# EAGLE design TPS24750V1_8A_editsV6 (EAGLE 8.0.0)
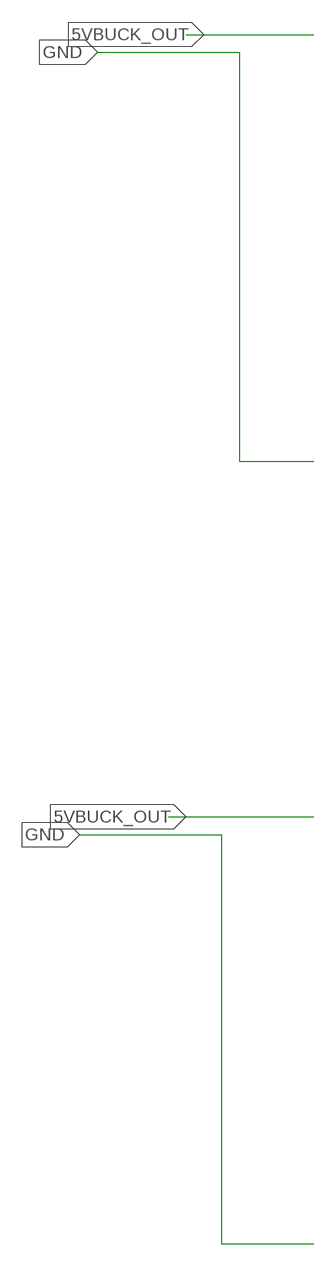
[diagram p0: schematic, sheet 1, part 1 of 3]
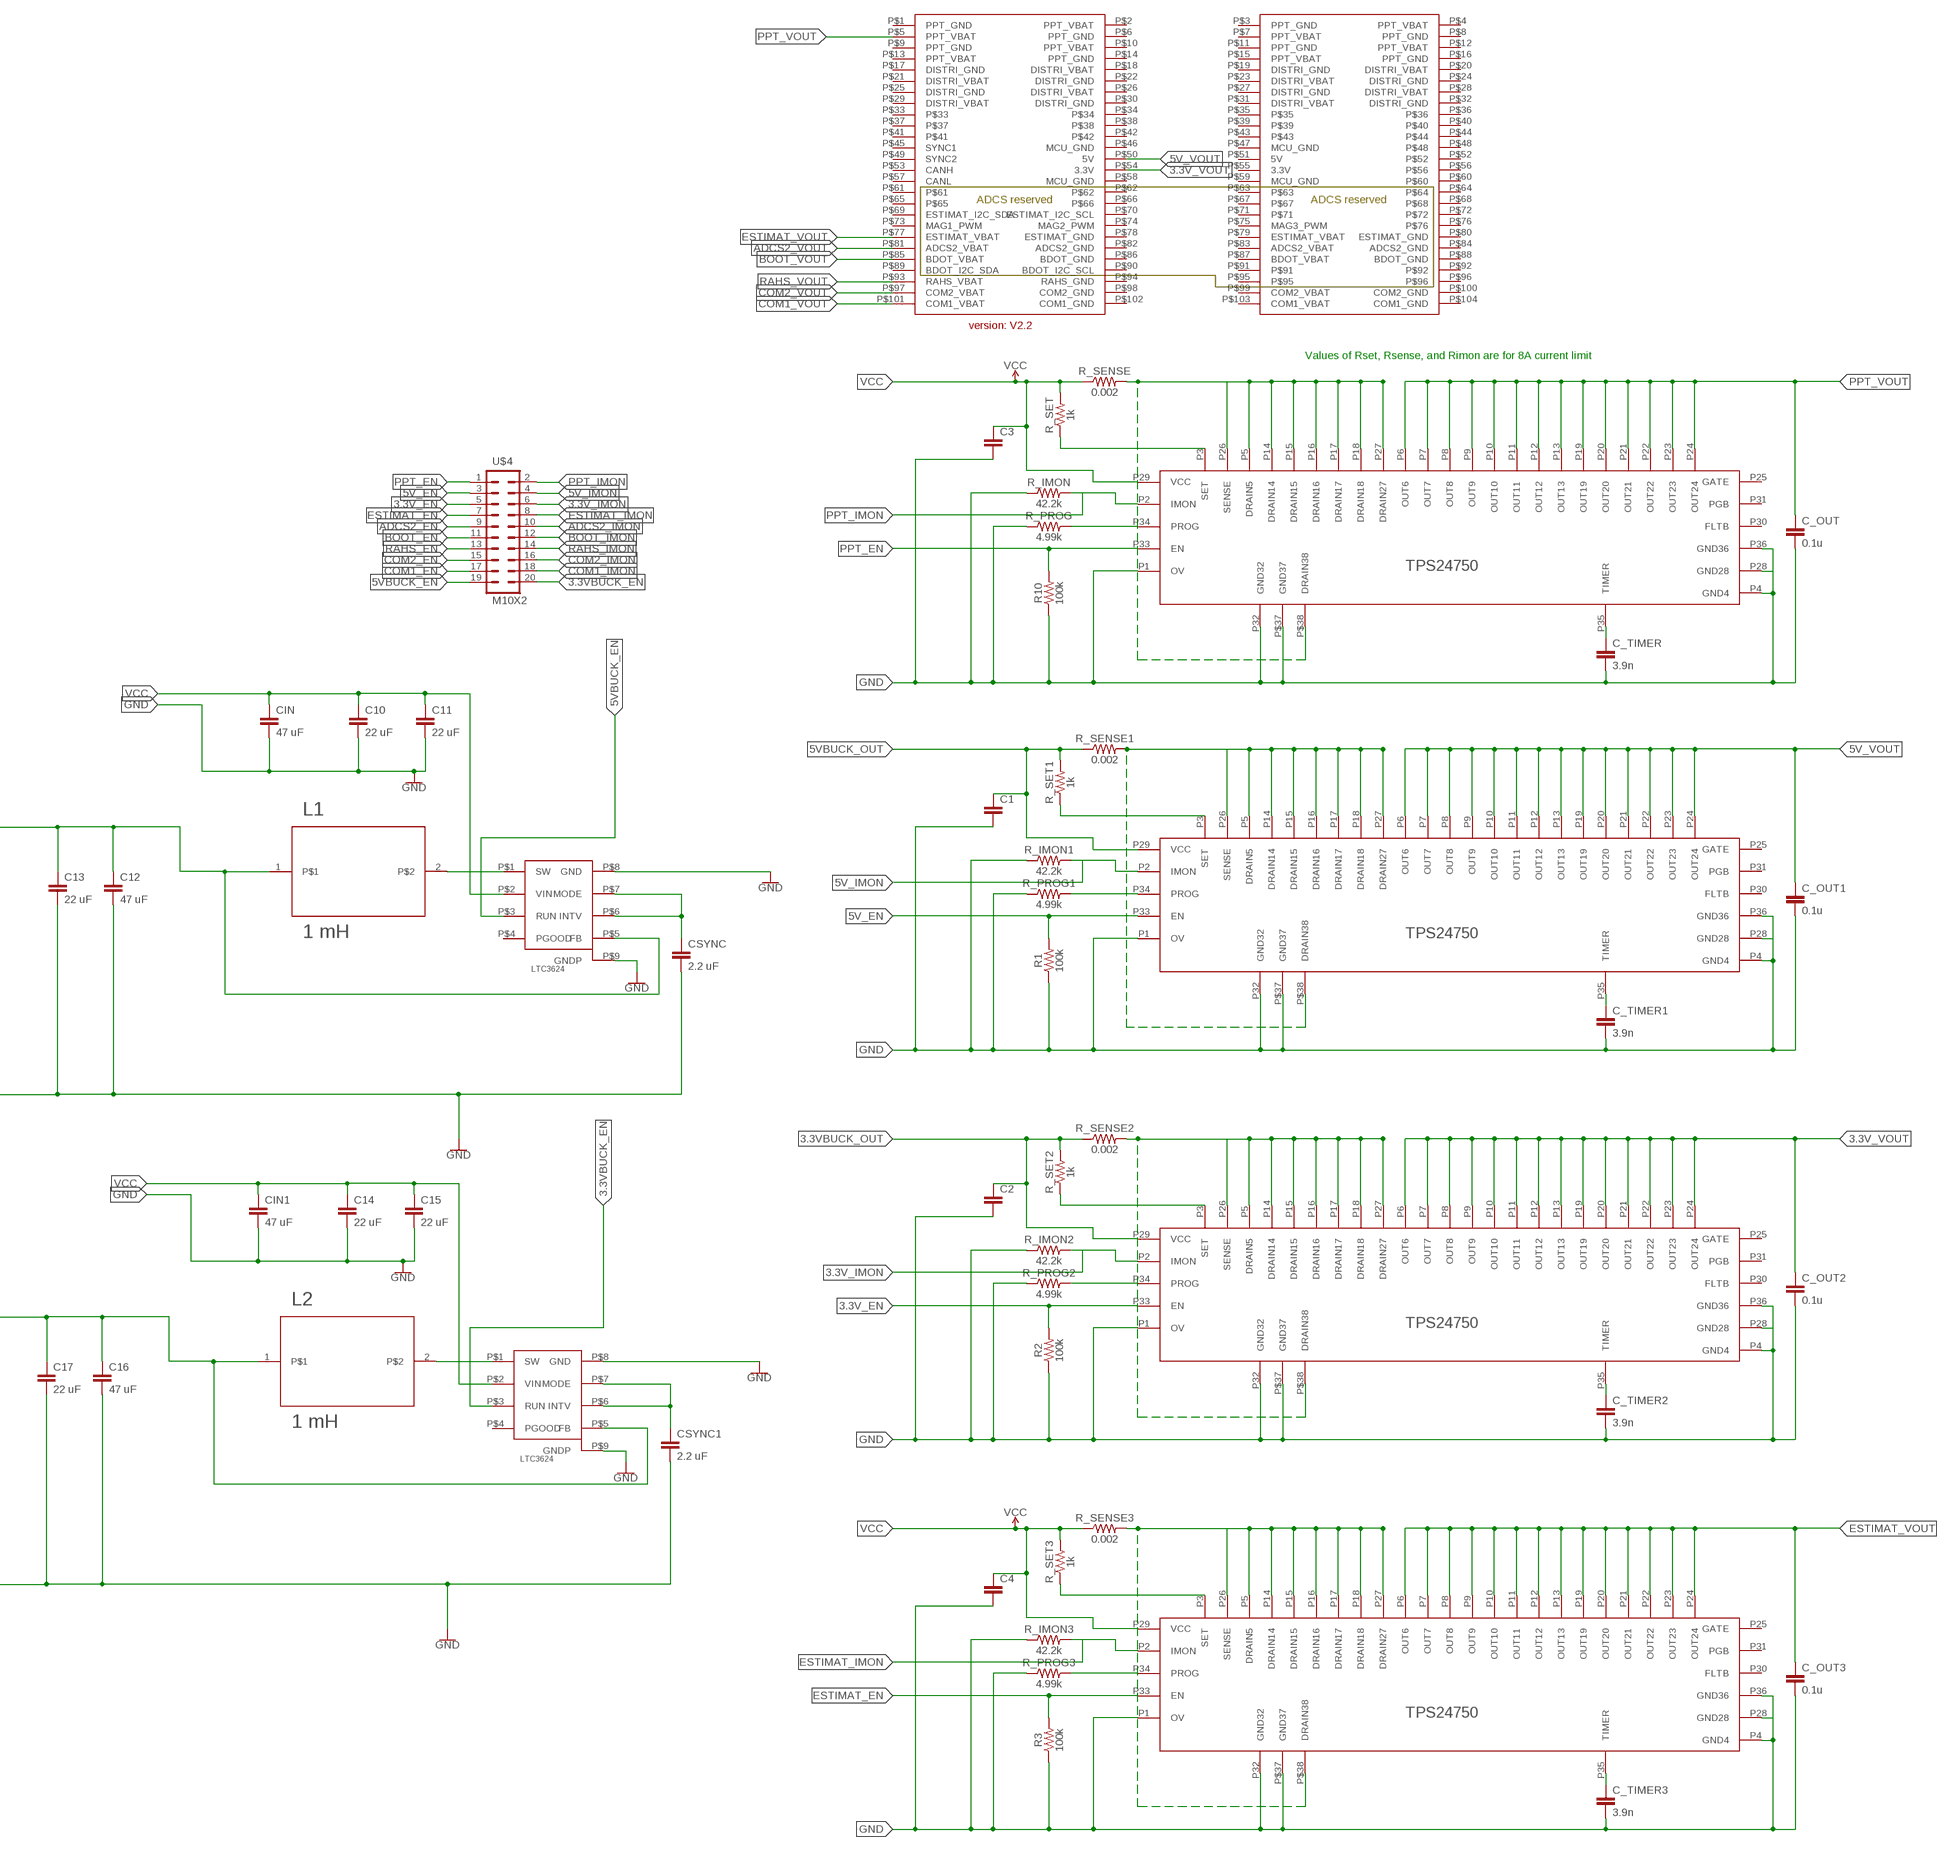
[diagram p1: schematic, sheet 1, part 2 of 3]
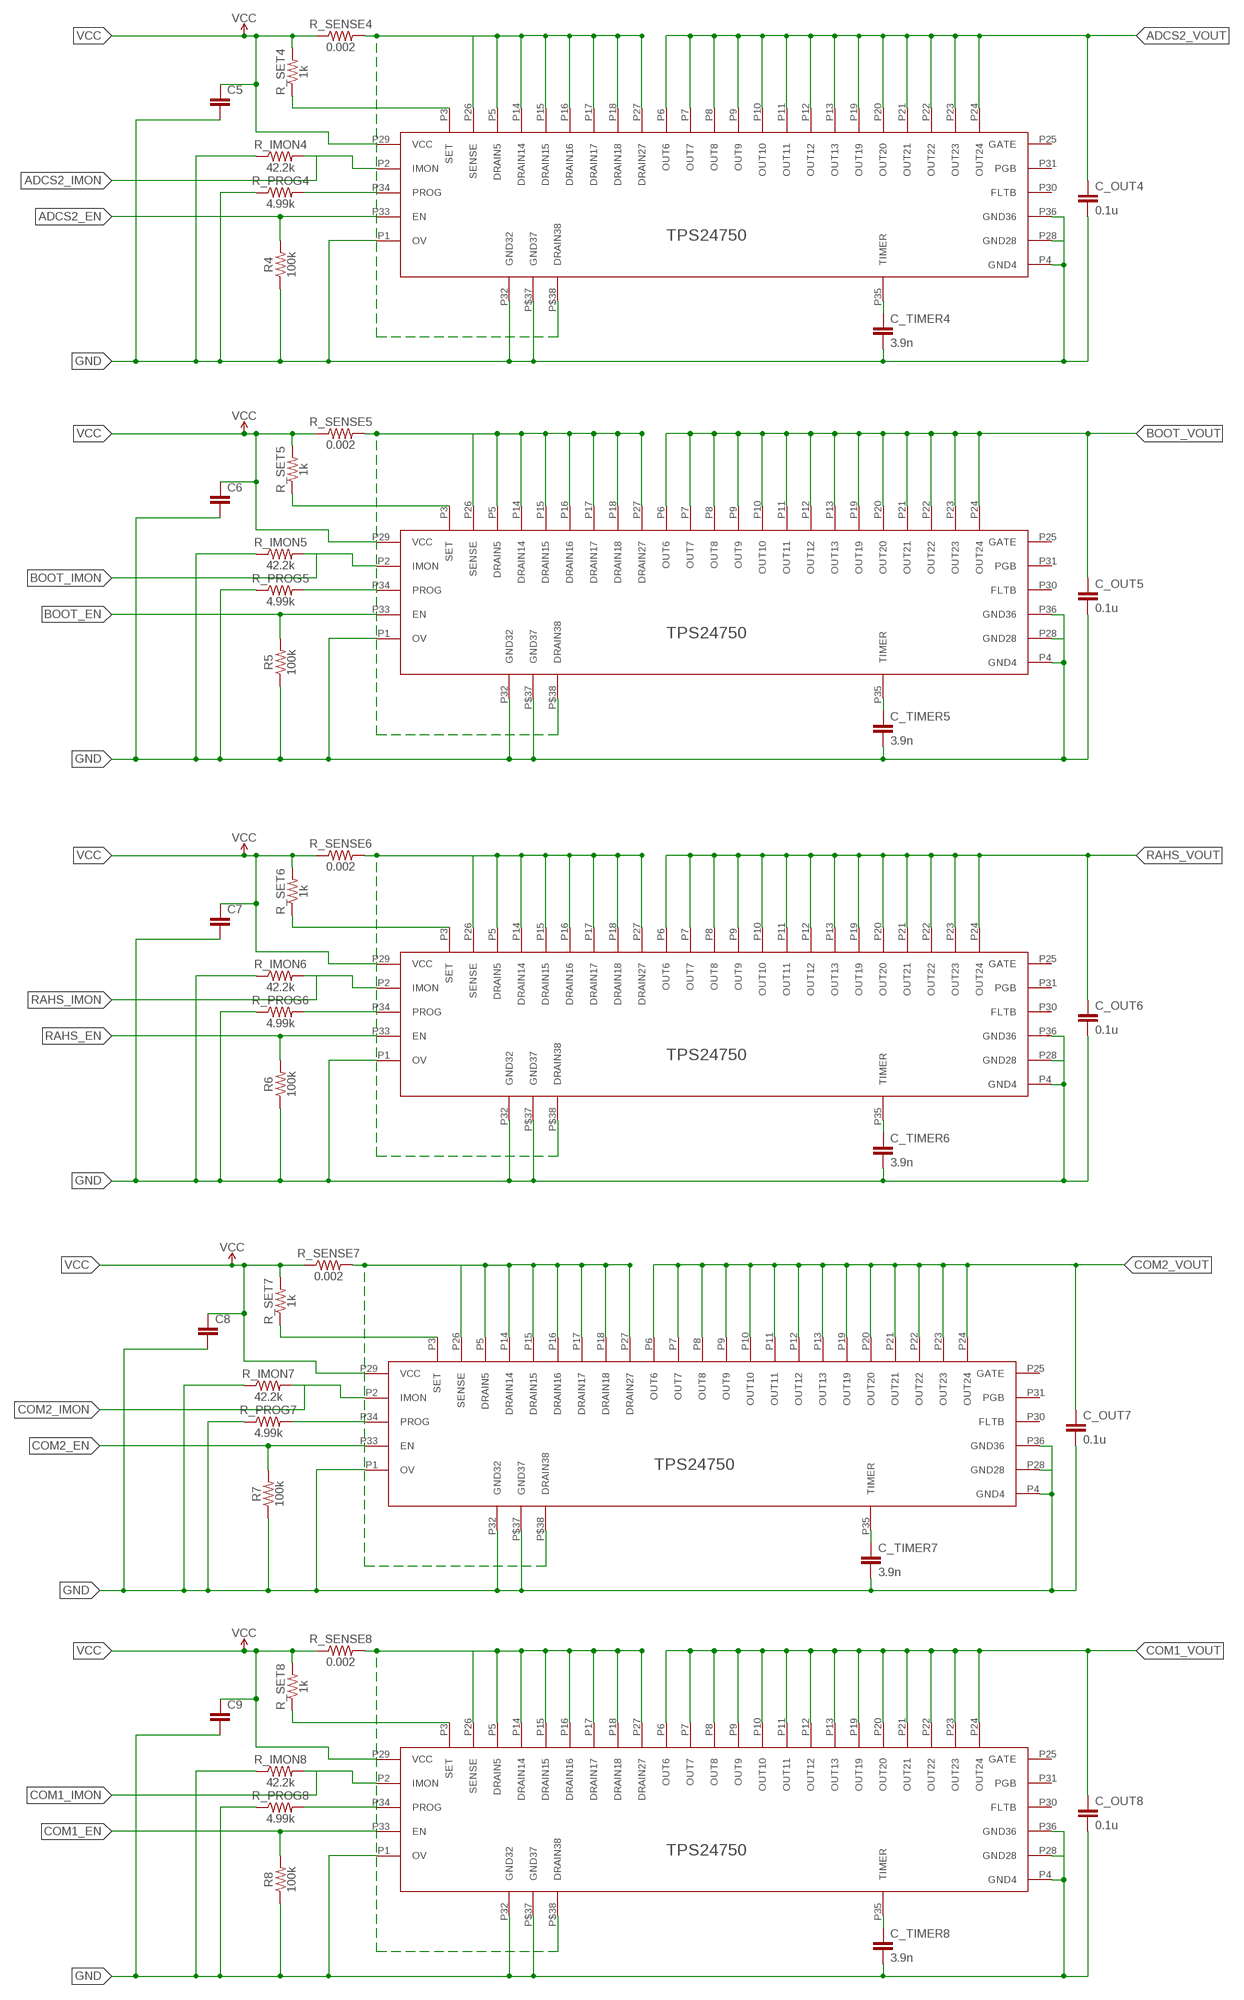
[diagram p2: schematic, sheet 1, part 3 of 3]

## Parts
C1  GEN_CAP_0805SMD  [0805]
C2  GEN_CAP_0805SMD  [0805]
C3  GEN_CAP_0805SMD  [0805]
C4  GEN_CAP_0805SMD  [0805]
C5  GEN_CAP_0805SMD  [0805]
C6  GEN_CAP_0805SMD  [0805]
C7  GEN_CAP_0805SMD  [0805]
C8  GEN_CAP_0805SMD  [0805]
C9  GEN_CAP_0805SMD  [0805]
C10  22 uF  GENERIC_CAPACITOR_1206  [1206]
C11  22 uF  GENERIC_CAPACITOR_1206  [1206]
C12  47 uF  GENERIC_CAPACITOR_1206  [1206]
C13  22 uF  GENERIC_CAPACITOR_1206  [1206]
C14  22 uF  GENERIC_CAPACITOR_1206  [1206]
C15  22 uF  GENERIC_CAPACITOR_1206  [1206]
C16  47 uF  GENERIC_CAPACITOR_1206  [1206]
C17  22 uF  GENERIC_CAPACITOR_1206  [1206]
C_OUT  0.1u  GEN_CAP_0805SMD  [0805]
C_OUT1  0.1u  GEN_CAP_0805SMD  [0805]
C_OUT2  0.1u  GEN_CAP_0805SMD  [0805]
C_OUT3  0.1u  GEN_CAP_0805SMD  [0805]
C_OUT4  0.1u  GEN_CAP_0805SMD  [0805]
C_OUT5  0.1u  GEN_CAP_0805SMD  [0805]
C_OUT6  0.1u  GEN_CAP_0805SMD  [0805]
C_OUT7  0.1u  GEN_CAP_0805SMD  [0805]
C_OUT8  0.1u  GEN_CAP_0805SMD  [0805]
C_TIMER  3.9n  GEN_CAP_0805SMD  [0805]
C_TIMER1  3.9n  GEN_CAP_0805SMD  [0805]
C_TIMER2  3.9n  GEN_CAP_0805SMD  [0805]
C_TIMER3  3.9n  GEN_CAP_0805SMD  [0805]
C_TIMER4  3.9n  GEN_CAP_0805SMD  [0805]
C_TIMER5  3.9n  GEN_CAP_0805SMD  [0805]
C_TIMER6  3.9n  GEN_CAP_0805SMD  [0805]
C_TIMER7  3.9n  GEN_CAP_0805SMD  [0805]
C_TIMER8  3.9n  GEN_CAP_0805SMD  [0805]
CIN  47 uF  GENERIC_CAPACITOR_1206  [1206]
CIN1  47 uF  GENERIC_CAPACITOR_1206  [1206]
CSYNC  2.2 uF  GENERIC_CAPACITOR_0805  [0805]
CSYNC1  2.2 uF  GENERIC_CAPACITOR_0805  [0805]
L1  1 mH  XAL4030-332ME  [COILCRAFT]
L2  1 mH  XAL4030-332ME  [COILCRAFT]
R1  100k  GEN_RES_0805SMD  [0805]
R2  100k  GEN_RES_0805SMD  [0805]
R3  100k  GEN_RES_0805SMD  [0805]
R4  100k  GEN_RES_0805SMD  [0805]
R5  100k  GEN_RES_0805SMD  [0805]
R6  100k  GEN_RES_0805SMD  [0805]
R7  100k  GEN_RES_0805SMD  [0805]
R8  100k  GEN_RES_0805SMD  [0805]
R10  100k  GEN_RES_0805SMD  [0805]
R_IMON  42.2k  GEN_RES_0805SMD  [0805]
R_IMON1  42.2k  GEN_RES_0805SMD  [0805]
R_IMON2  42.2k  GEN_RES_0805SMD  [0805]
R_IMON3  42.2k  GEN_RES_0805SMD  [0805]
R_IMON4  42.2k  GEN_RES_0805SMD  [0805]
R_IMON5  42.2k  GEN_RES_0805SMD  [0805]
R_IMON6  42.2k  GEN_RES_0805SMD  [0805]
R_IMON7  42.2k  GEN_RES_0805SMD  [0805]
R_IMON8  42.2k  GEN_RES_0805SMD  [0805]
R_PROG  4.99k  GEN_RES_0805SMD  [0805]
R_PROG1  4.99k  GEN_RES_0805SMD  [0805]
R_PROG2  4.99k  GEN_RES_0805SMD  [0805]
R_PROG3  4.99k  GEN_RES_0805SMD  [0805]
R_PROG4  4.99k  GEN_RES_0805SMD  [0805]
R_PROG5  4.99k  GEN_RES_0805SMD  [0805]
R_PROG6  4.99k  GEN_RES_0805SMD  [0805]
R_PROG7  4.99k  GEN_RES_0805SMD  [0805]
R_PROG8  4.99k  GEN_RES_0805SMD  [0805]
R_SENSE  0.002  GEN_RES_2010SMD  [2010]
R_SENSE1  0.002  GEN_RES_2010SMD  [2010]
R_SENSE2  0.002  GEN_RES_2010SMD  [2010]
R_SENSE3  0.002  GEN_RES_2010SMD  [2010]
R_SENSE4  0.002  GEN_RES_2010SMD  [2010]
R_SENSE5  0.002  GEN_RES_2010SMD  [2010]
R_SENSE6  0.002  GEN_RES_2010SMD  [2010]
R_SENSE7  0.002  GEN_RES_2010SMD  [2010]
R_SENSE8  0.002  GEN_RES_2010SMD  [2010]
R_SET  1k  GEN_RES_0805SMD  [0805]
R_SET1  1k  GEN_RES_0805SMD  [0805]
R_SET2  1k  GEN_RES_0805SMD  [0805]
R_SET3  1k  GEN_RES_0805SMD  [0805]
R_SET4  1k  GEN_RES_0805SMD  [0805]
R_SET5  1k  GEN_RES_0805SMD  [0805]
R_SET6  1k  GEN_RES_0805SMD  [0805]
R_SET7  1k  GEN_RES_0805SMD  [0805]
R_SET8  1k  GEN_RES_0805SMD  [0805]
U$1  TI_SWITCH_TPS24750  [QFN-36]
U$2  2X26_CONNECTOR_(V2.2)  [4X26_CONNECTOR_(V2.2)]
U$4  M10X2  [2X10]
U$5  TI_SWITCH_TPS24750  [QFN-36]
U$6  TI_SWITCH_TPS24750  [QFN-36]
U$7  TI_SWITCH_TPS24750  [QFN-36]
U$8  TI_SWITCH_TPS24750  [QFN-36]
U$9  TI_SWITCH_TPS24750  [QFN-36]
U$10  TI_SWITCH_TPS24750  [QFN-36]
U$11  TI_SWITCH_TPS24750  [QFN-36]
U$12  TI_SWITCH_TPS24750  [QFN-36]
U$13  LINEAR_BUCK_LTC3624  [8-LFCSP]
U$14  LINEAR_BUCK_LTC3624  [8-LFCSP]

## Nets
3.3V_EN: R2.2 U$4.5 U$6.P33(EN)
3.3V_IMON: R_IMON2.2 U$4.6 U$6.P2(IMON)
3.3V_VOUT: C_OUT2.1 U$2.P$54(3.3V) U$6.P6(OUT6) U$6.P7(OUT7) U$6.P8(OUT8) U$6.P9(OUT9) U$6.P10(OUT10) U$6.P11(OUT11) U$6.P12(OUT12) U$6.P13(OUT13) U$6.P19(OUT19) U$6.P20(OUT20) U$6.P21(OUT21) U$6.P22(OUT22) U$6.P23(OUT23) U$6.P24(OUT24)
3.3VBUCK_EN: U$4.20 U$14.P$3(RUN)
3.3VBUCK_OUT: C2.1 C16.1 C17.1 L2.1 R_SENSE2.1 R_SET2.2 U$6.P29(VCC) U$14.P$5(FB)
5V_EN: R1.2 U$4.3 U$5.P33(EN)
5V_IMON: R_IMON1.2 U$4.4 U$5.P2(IMON)
5V_VOUT: C_OUT1.1 U$2.P$50(5V) U$5.P6(OUT6) U$5.P7(OUT7) U$5.P8(OUT8) U$5.P9(OUT9) U$5.P10(OUT10) U$5.P11(OUT11) U$5.P12(OUT12) U$5.P13(OUT13) U$5.P19(OUT19) U$5.P20(OUT20) U$5.P21(OUT21) U$5.P22(OUT22) U$5.P23(OUT23) U$5.P24(OUT24)
5VBUCK_EN: U$4.19 U$13.P$3(RUN)
5VBUCK_OUT: C1.1 C12.1 C13.1 L1.1 R_SENSE1.1 R_SET1.2 U$5.P29(VCC) U$13.P$5(FB)
ADCS2_EN: R4.2 U$4.9 U$8.P33(EN)
ADCS2_IMON: R_IMON4.2 U$4.10 U$8.P2(IMON)
ADCS2_VOUT: C_OUT4.1 U$2.P$81(ADCS2_VBAT) U$8.P6(OUT6) U$8.P7(OUT7) U$8.P8(OUT8) U$8.P9(OUT9) U$8.P10(OUT10) U$8.P11(OUT11) U$8.P12(OUT12) U$8.P13(OUT13) U$8.P19(OUT19) U$8.P20(OUT20) U$8.P21(OUT21) U$8.P22(OUT22) U$8.P23(OUT23) U$8.P24(OUT24)
BOOT_EN: R5.2 U$9.P33(EN)
BOOT_IMON: R_IMON5.2 U$9.P2(IMON)
BOOT_VOUT: C_OUT5.1 U$2.P$85(BDOT_VBAT) U$9.P6(OUT6) U$9.P7(OUT7) U$9.P8(OUT8) U$9.P9(OUT9) U$9.P10(OUT10) U$9.P11(OUT11) U$9.P12(OUT12) U$9.P13(OUT13) U$9.P19(OUT19) U$9.P20(OUT20) U$9.P21(OUT21) U$9.P22(OUT22) U$9.P23(OUT23) U$9.P24(OUT24)
COM1_EN: R8.2 U$4.17 U$12.P33(EN)
COM1_IMON: R_IMON8.2 U$12.P2(IMON)
COM1_VOUT: C_OUT8.1 U$2.P$101(COM1_VBAT) U$12.P6(OUT6) U$12.P7(OUT7) U$12.P8(OUT8) U$12.P9(OUT9) U$12.P10(OUT10) U$12.P11(OUT11) U$12.P12(OUT12) U$12.P13(OUT13) U$12.P19(OUT19) U$12.P20(OUT20) U$12.P21(OUT21) U$12.P22(OUT22) U$12.P23(OUT23) U$12.P24(OUT24)
COM2_EN: R7.2 U$11.P33(EN)
COM2_IMON: R_IMON7.2 U$4.16 U$11.P2(IMON)
COM2_VOUT: C_OUT7.1 U$2.P$97(COM2_VBAT) U$11.P6(OUT6) U$11.P7(OUT7) U$11.P8(OUT8) U$11.P9(OUT9) U$11.P10(OUT10) U$11.P11(OUT11) U$11.P12(OUT12) U$11.P13(OUT13) U$11.P19(OUT19) U$11.P20(OUT20) U$11.P21(OUT21) U$11.P22(OUT22) U$11.P23(OUT23) U$11.P24(OUT24)
DRAIN: R_SENSE.2 U$1.P5(DRAIN5) U$1.P14(DRAIN14) U$1.P15(DRAIN15) U$1.P16(DRAIN16) U$1.P17(DRAIN17) U$1.P18(DRAIN18) U$1.P26(SENSE) U$1.P27(DRAIN27) U$1.P$38(DRAIN38)
DRAIN1: R_SENSE1.2 U$5.P5(DRAIN5) U$5.P14(DRAIN14) U$5.P15(DRAIN15) U$5.P16(DRAIN16) U$5.P17(DRAIN17) U$5.P18(DRAIN18) U$5.P26(SENSE) U$5.P27(DRAIN27) U$5.P$38(DRAIN38)
DRAIN2: R_SENSE2.2 U$6.P5(DRAIN5) U$6.P14(DRAIN14) U$6.P15(DRAIN15) U$6.P16(DRAIN16) U$6.P17(DRAIN17) U$6.P18(DRAIN18) U$6.P26(SENSE) U$6.P27(DRAIN27) U$6.P$38(DRAIN38)
DRAIN3: R_SENSE3.2 U$7.P5(DRAIN5) U$7.P14(DRAIN14) U$7.P15(DRAIN15) U$7.P16(DRAIN16) U$7.P17(DRAIN17) U$7.P18(DRAIN18) U$7.P26(SENSE) U$7.P27(DRAIN27) U$7.P$38(DRAIN38)
DRAIN4: R_SENSE4.2 U$8.P5(DRAIN5) U$8.P14(DRAIN14) U$8.P15(DRAIN15) U$8.P16(DRAIN16) U$8.P17(DRAIN17) U$8.P18(DRAIN18) U$8.P26(SENSE) U$8.P27(DRAIN27) U$8.P$38(DRAIN38)
DRAIN5: R_SENSE5.2 U$9.P5(DRAIN5) U$9.P14(DRAIN14) U$9.P15(DRAIN15) U$9.P16(DRAIN16) U$9.P17(DRAIN17) U$9.P18(DRAIN18) U$9.P26(SENSE) U$9.P27(DRAIN27) U$9.P$38(DRAIN38)
DRAIN6: R_SENSE6.2 U$10.P5(DRAIN5) U$10.P14(DRAIN14) U$10.P15(DRAIN15) U$10.P16(DRAIN16) U$10.P17(DRAIN17) U$10.P18(DRAIN18) U$10.P26(SENSE) U$10.P27(DRAIN27) U$10.P$38(DRAIN38)
DRAIN7: R_SENSE7.2 U$11.P5(DRAIN5) U$11.P14(DRAIN14) U$11.P15(DRAIN15) U$11.P16(DRAIN16) U$11.P17(DRAIN17) U$11.P18(DRAIN18) U$11.P26(SENSE) U$11.P27(DRAIN27) U$11.P$38(DRAIN38)
DRAIN8: R_SENSE8.2 U$12.P5(DRAIN5) U$12.P14(DRAIN14) U$12.P15(DRAIN15) U$12.P16(DRAIN16) U$12.P17(DRAIN17) U$12.P18(DRAIN18) U$12.P26(SENSE) U$12.P27(DRAIN27) U$12.P$38(DRAIN38)
ESTIMAT_EN: R3.2 U$4.7 U$7.P33(EN)
ESTIMAT_IMON: R_IMON3.2 U$4.8 U$7.P2(IMON)
ESTIMAT_VOUT: C_OUT3.1 U$2.P$77(ESTIMAT_VBAT) U$7.P6(OUT6) U$7.P7(OUT7) U$7.P8(OUT8) U$7.P9(OUT9) U$7.P10(OUT10) U$7.P11(OUT11) U$7.P12(OUT12) U$7.P13(OUT13) U$7.P19(OUT19) U$7.P20(OUT20) U$7.P21(OUT21) U$7.P22(OUT22) U$7.P23(OUT23) U$7.P24(OUT24)
GND: C1.2 C2.2 C3.2 C4.2 C5.2 C6.2 C7.2 C8.2 C9.2 C10.2 C11.2 C12.2 C13.2 C14.2 C15.2 C16.2 C17.2 C_OUT1.2 C_OUT2.2 C_OUT3.2 C_OUT4.2 C_OUT5.2 C_OUT6.2 C_OUT7.2 C_OUT8.2 C_OUT.2 C_TIMER1.2 C_TIMER2.2 C_TIMER3.2 C_TIMER4.2 C_TIMER5.2 C_TIMER6.2 C_TIMER7.2 C_TIMER8.2 C_TIMER.2 CIN1.2 CIN.2 CSYNC1.2 CSYNC.2 R1.1 R2.1 R3.1 R4.1 R5.1 R6.1 R7.1 R8.1 R10.1 R_IMON1.1 R_IMON2.1 R_IMON3.1 R_IMON4.1 R_IMON5.1 R_IMON6.1 R_IMON7.1 R_IMON8.1 R_IMON.1 R_PROG1.1 R_PROG2.1 R_PROG3.1 R_PROG4.1 R_PROG5.1 R_PROG6.1 R_PROG7.1 R_PROG8.1 R_PROG.1 U$1.P1(OV) U$1.P4(GND4) U$1.P28(GND28) U$1.P32(GND32) U$1.P36(GND36) U$1.P$37(GND37) U$5.P1(OV) U$5.P4(GND4) U$5.P28(GND28) U$5.P32(GND32) U$5.P36(GND36) U$5.P$37(GND37) U$6.P1(OV) U$6.P4(GND4) U$6.P28(GND28) U$6.P32(GND32) U$6.P36(GND36) U$6.P$37(GND37) U$7.P1(OV) U$7.P4(GND4) U$7.P28(GND28) U$7.P32(GND32) U$7.P36(GND36) U$7.P$37(GND37) U$8.P1(OV) U$8.P4(GND4) U$8.P28(GND28) U$8.P32(GND32) U$8.P36(GND36) U$8.P$37(GND37) U$9.P1(OV) U$9.P4(GND4) U$9.P28(GND28) U$9.P32(GND32) U$9.P36(GND36) U$9.P$37(GND37) U$10.P1(OV) U$10.P4(GND4) U$10.P28(GND28) U$10.P32(GND32) U$10.P36(GND36) U$10.P$37(GND37) U$11.P1(OV) U$11.P4(GND4) U$11.P28(GND28) U$11.P32(GND32) U$11.P36(GND36) U$11.P$37(GND37) U$12.P1(OV) U$12.P4(GND4) U$12.P28(GND28) U$12.P32(GND32) U$12.P36(GND36) U$12.P$37(GND37) U$13.P$8(GND) U$13.P$9(GNDP) U$14.P$8(GND) U$14.P$9(GNDP)
INPUT6_EN: U$4.11
INPUT6_IMON: U$4.12
INPUT8_EN: U$4.15
INPUT9_IMON: U$4.18
MODE: CSYNC.1 U$13.P$6(INTV) U$13.P$7(MODE)
MODE1: CSYNC1.1 U$14.P$6(INTV) U$14.P$7(MODE)
PPT_EN: R10.2 U$1.P33(EN) U$4.1
PPT_IMON: R_IMON.2 U$1.P2(IMON) U$4.2
PPT_VOUT: C_OUT.1 U$1.P6(OUT6) U$1.P7(OUT7) U$1.P8(OUT8) U$1.P9(OUT9) U$1.P10(OUT10) U$1.P11(OUT11) U$1.P12(OUT12) U$1.P13(OUT13) U$1.P19(OUT19) U$1.P20(OUT20) U$1.P21(OUT21) U$1.P22(OUT22) U$1.P23(OUT23) U$1.P24(OUT24) U$2.P$5(PPT_VBAT)
PROG: R_PROG.2 U$1.P34(PROG)
PROG1: R_PROG1.2 U$5.P34(PROG)
PROG2: R_PROG2.2 U$6.P34(PROG)
PROG3: R_PROG3.2 U$7.P34(PROG)
PROG4: R_PROG4.2 U$8.P34(PROG)
PROG5: R_PROG5.2 U$9.P34(PROG)
PROG6: R_PROG6.2 U$10.P34(PROG)
PROG7: R_PROG7.2 U$11.P34(PROG)
PROG8: R_PROG8.2 U$12.P34(PROG)
RAHS_EN: R6.2 U$4.13 U$10.P33(EN)
RAHS_IMON: R_IMON6.2 U$4.14 U$10.P2(IMON)
RAHS_VOUT: C_OUT6.1 U$2.P$93(RAHS_VBAT) U$10.P6(OUT6) U$10.P7(OUT7) U$10.P8(OUT8) U$10.P9(OUT9) U$10.P10(OUT10) U$10.P11(OUT11) U$10.P12(OUT12) U$10.P13(OUT13) U$10.P19(OUT19) U$10.P20(OUT20) U$10.P21(OUT21) U$10.P22(OUT22) U$10.P23(OUT23) U$10.P24(OUT24)
SET: R_SET.1 U$1.P3(SET)
SET1: R_SET1.1 U$5.P3(SET)
SET2: R_SET2.1 U$6.P3(SET)
SET3: R_SET3.1 U$7.P3(SET)
SET4: R_SET4.1 U$8.P3(SET)
SET5: R_SET5.1 U$9.P3(SET)
SET6: R_SET6.1 U$10.P3(SET)
SET7: R_SET7.1 U$11.P3(SET)
SET8: R_SET8.1 U$12.P3(SET)
SW: L1.2 U$13.P$1(SW)
SW1: L2.2 U$14.P$1(SW)
TIMER: C_TIMER.1 U$1.P35(TIMER)
TIMER1: C_TIMER1.1 U$5.P35(TIMER)
TIMER2: C_TIMER2.1 U$6.P35(TIMER)
TIMER3: C_TIMER3.1 U$7.P35(TIMER)
TIMER4: C_TIMER4.1 U$8.P35(TIMER)
TIMER5: C_TIMER5.1 U$9.P35(TIMER)
TIMER6: C_TIMER6.1 U$10.P35(TIMER)
TIMER7: C_TIMER7.1 U$11.P35(TIMER)
TIMER8: C_TIMER8.1 U$12.P35(TIMER)
VCC: C3.1 C4.1 C5.1 C6.1 C7.1 C8.1 C9.1 C10.1 C11.1 C14.1 C15.1 CIN1.1 CIN.1 R_SENSE3.1 R_SENSE4.1 R_SENSE5.1 R_SENSE6.1 R_SENSE7.1 R_SENSE8.1 R_SENSE.1 R_SET3.2 R_SET4.2 R_SET5.2 R_SET6.2 R_SET7.2 R_SET8.2 R_SET.2 U$1.P29(VCC) U$7.P29(VCC) U$8.P29(VCC) U$9.P29(VCC) U$10.P29(VCC) U$11.P29(VCC) U$12.P29(VCC) U$13.P$2(VIN) U$14.P$2(VIN)
Unconnected: U$1.P25(GATE) U$1.P30(FLTB) U$1.P31(PGB) U$2.P$1(PPT_GND) U$2.P$2(PPT_VBAT) U$2.P$3(PPT_GND) U$2.P$4(PPT_VBAT) U$2.P$6(PPT_GND) U$2.P$7(PPT_VBAT) U$2.P$8(PPT_GND) U$2.P$9(PPT_GND) U$2.P$10(PPT_VBAT) U$2.P$11(PPT_GND) U$2.P$12(PPT_VBAT) U$2.P$13(PPT_VBAT) U$2.P$14(PPT_GND) U$2.P$15(PPT_VBAT) U$2.P$16(PPT_GND) U$2.P$17(DISTRI_GND) U$2.P$18(DISTRI_VBAT) U$2.P$19(DISTRI_GND) U$2.P$20(DISTRI_VBAT) U$2.P$21(DISTRI_VBAT) U$2.P$22(DISTRI_GND) U$2.P$23(DISTRI_VBAT) U$2.P$24(DISTRI_GND) U$2.P$25(DISTRI_GND) U$2.P$26(DISTRI_VBAT) U$2.P$27(DISTRI_GND) U$2.P$28(DISTRI_VBAT) U$2.P$29(DISTRI_VBAT) U$2.P$30(DISTRI_GND) U$2.P$31(DISTRI_VBAT) U$2.P$32(DISTRI_GND) U$2.P$33 U$2.P$34 U$2.P$35 U$2.P$36 U$2.P$37 U$2.P$38 U$2.P$39 U$2.P$40 U$2.P$41 U$2.P$42 U$2.P$43 U$2.P$44 U$2.P$45(SYNC1) U$2.P$46(MCU_GND) U$2.P$47(MCU_GND) U$2.P$48 U$2.P$49(SYNC2) U$2.P$51(5V) U$2.P$52 U$2.P$53(CANH) U$2.P$55(3.3V) U$2.P$56 U$2.P$57(CANL) U$2.P$58(MCU_GND) U$2.P$59(MCU_GND) U$2.P$60 U$2.P$61 U$2.P$62 U$2.P$63 U$2.P$64 U$2.P$65 U$2.P$66 U$2.P$67 U$2.P$68 U$2.P$69(ESTIMAT_I2C_SDA) U$2.P$70(ESTIMAT_I2C_SCL) U$2.P$71 U$2.P$72 U$2.P$73(MAG1_PWM) U$2.P$74(MAG2_PWM) U$2.P$75(MAG3_PWM) U$2.P$76 U$2.P$78(ESTIMAT_GND) U$2.P$79(ESTIMAT_VBAT) U$2.P$80(ESTIMAT_GND) U$2.P$82(ADCS2_GND) U$2.P$83(ADCS2_VBAT) U$2.P$84(ADCS2_GND) U$2.P$86(BDOT_GND) U$2.P$87(BDOT_VBAT) U$2.P$88(BDOT_GND) U$2.P$89(BDOT_I2C_SDA) U$2.P$90(BDOT_I2C_SCL) U$2.P$91 U$2.P$92 U$2.P$94(RAHS_GND) U$2.P$95 U$2.P$96 U$2.P$98(COM2_GND) U$2.P$99(COM2_VBAT) U$2.P$100(COM2_GND) U$2.P$102(COM1_GND) U$2.P$103(COM1_VBAT) U$2.P$104(COM1_GND) U$5.P25(GATE) U$5.P30(FLTB) U$5.P31(PGB) U$6.P25(GATE) U$6.P30(FLTB) U$6.P31(PGB) U$7.P25(GATE) U$7.P30(FLTB) U$7.P31(PGB) U$8.P25(GATE) U$8.P30(FLTB) U$8.P31(PGB) U$9.P25(GATE) U$9.P30(FLTB) U$9.P31(PGB) U$10.P25(GATE) U$10.P30(FLTB) U$10.P31(PGB) U$11.P25(GATE) U$11.P30(FLTB) U$11.P31(PGB) U$12.P25(GATE) U$12.P30(FLTB) U$12.P31(PGB) U$13.P$4(PGOOD) U$14.P$4(PGOOD)

## Notes on the sheet
- Values of Rset, Rsense, and Rimon are for 8A current limit

## Library data of the parts
C1-C9 C_OUT C_OUT1-C_OUT8 C_TIMER C_TIMER1-C_TIMER8 = SparkFun-Capacitors:GEN_CAP_0805
C10-C17 CIN CIN1 = SparkFun-Capacitors:GENERIC_CAPACITOR_1206
CSYNC CSYNC1 = SparkFun-Capacitors:GENERIC_CAPACITOR_0805
L1 L2 = Inductors:XAL4030-332ME
R1-R8 R10 R_IMON R_IMON1-R_IMON8 R_PROG R_PROG1-R_PROG8 R_SET R_SET1-R_SET8 = SparkFun-Resistors:GEN_RES_0805: Generic resistor with no value
R_SENSE R_SENSE1-R_SENSE8 = SparkFun-Resistors:GEN_RES_2010
U$1 U$5-U$12 = ICs:TI_SWITCH_TPS24750
U$2 = CubeSat(V2.2):2X26_CONNECTOR_(V2.2)
U$4 = SparkFun-Connectors:M10X2: This was SPECIALLY designed to be used with our Graphic LCD Backpack. Be sure you want to use this! It is not only staggered on each line of header holes, but IT IS ALSO offset of the center point of the top and bottom lines by 5 mil. This causes the headers to lock into place on the "standard" footprint on the LCD screen. The extra squares on the tdocu layer are there simply to reference other pins (if you were to actually populate a longer header than ten long - this is what we do with the backpacks).
U$13 U$14 = ICs:LINEAR_BUCK_LTC3624

## Board
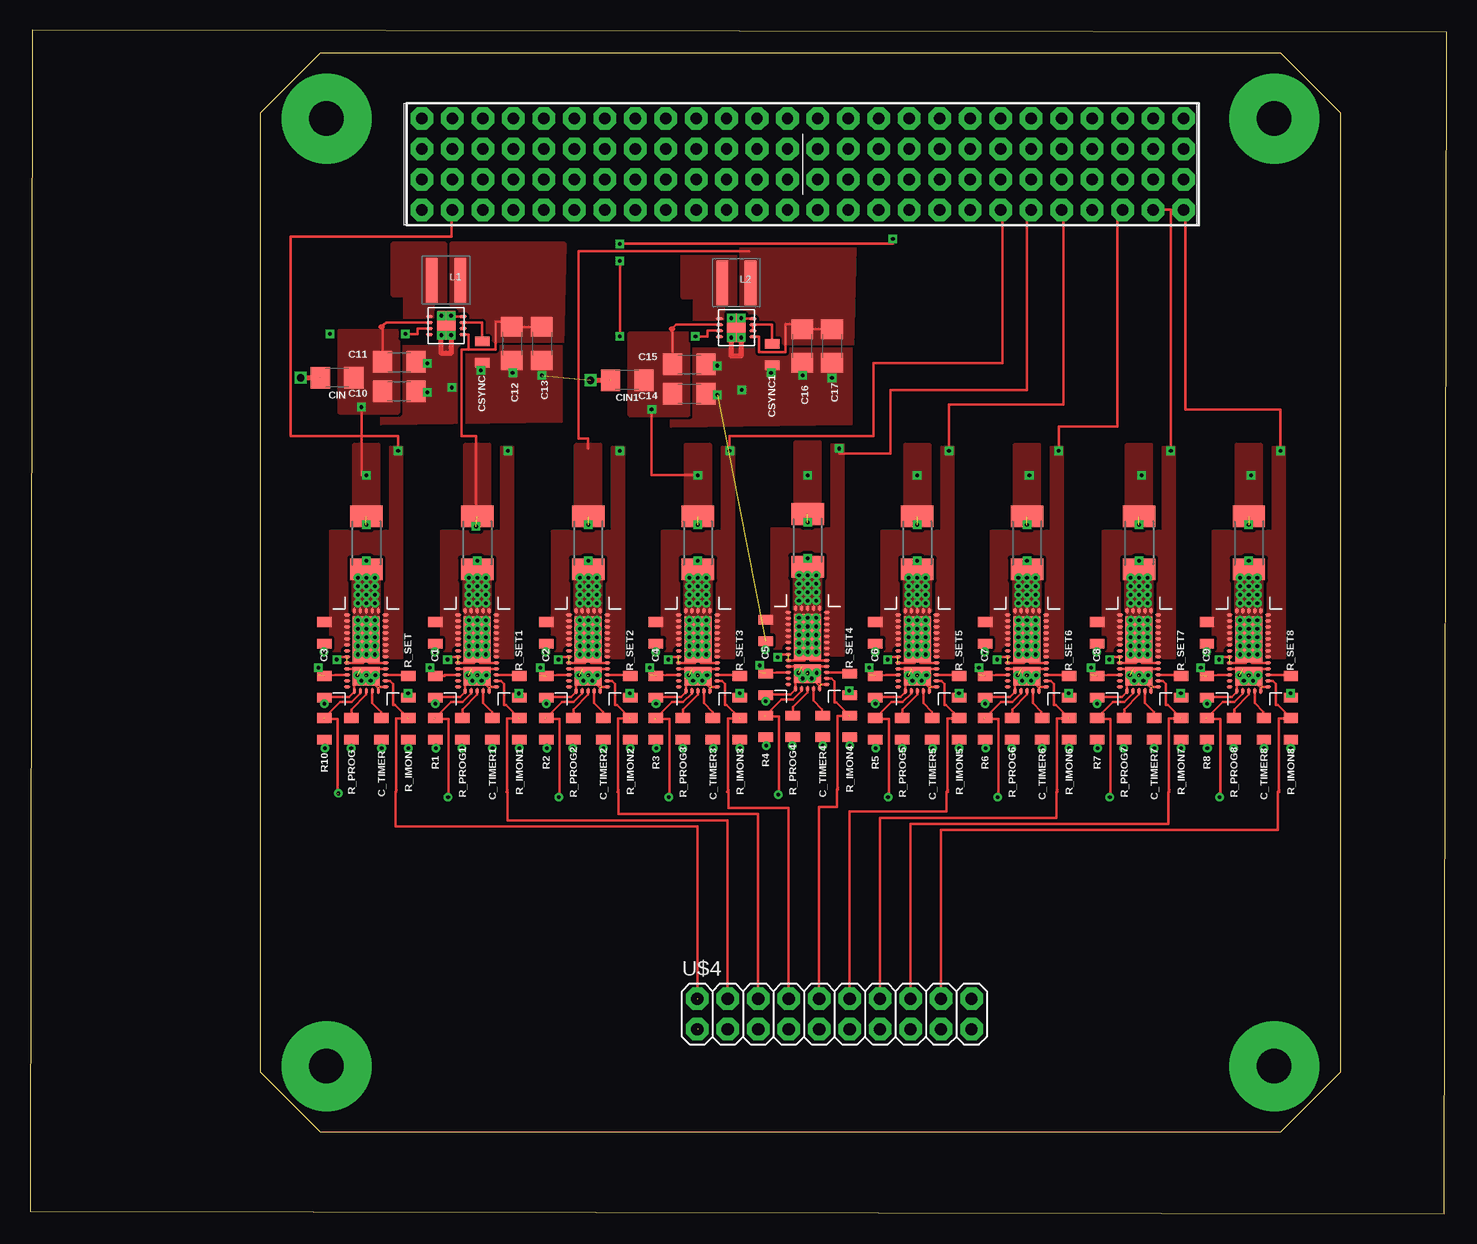
[diagram p3: board, top side]
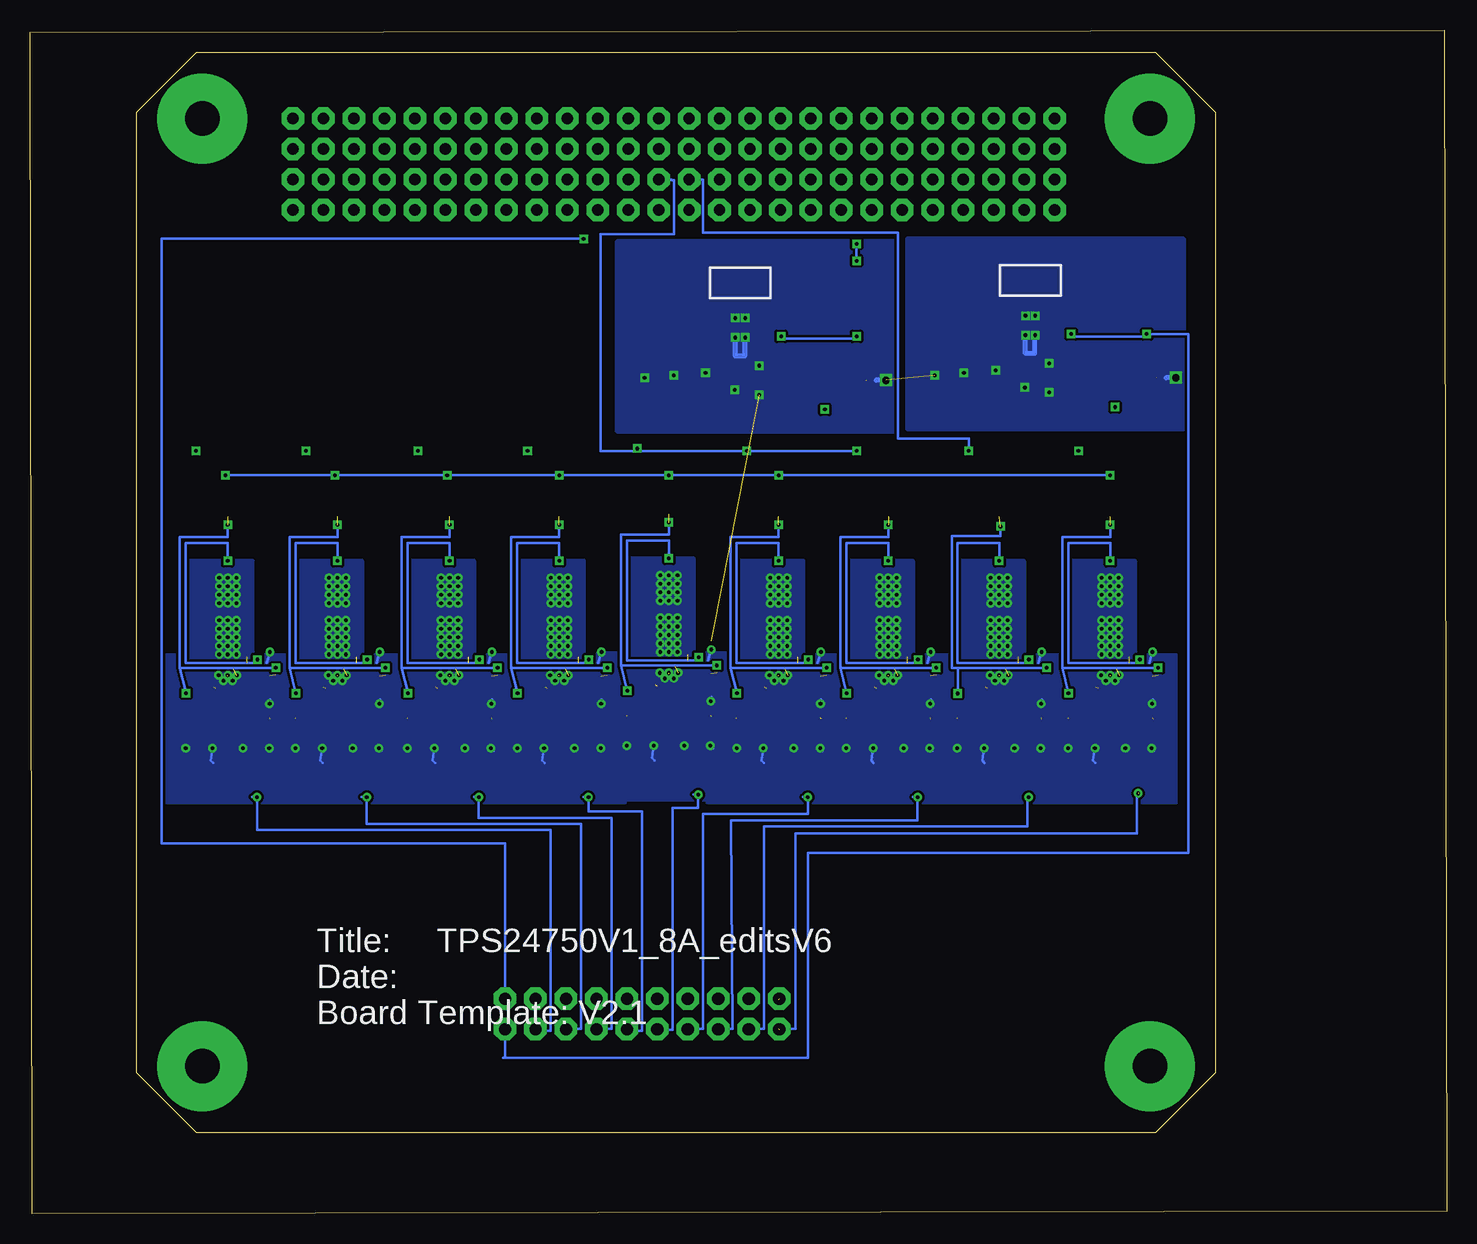
[diagram p4: board, bottom side, seen from below]

Size 118.08 x 98.69 mm. Coordinates in mm from the lower left corner, seen from the top.
Outline: 0,0.2 117.88,0 118.08,98.49 0.2,98.69 0,0.2
Copper layers (1*16): Top 0.035mm / dielectric 1.5mm / Bottom 0.035mm
Design rules "default": minimum track width 10mil, minimum drill 24mil, track to track 8mil, track to pad 8mil, pad to pad 8mil, via to via 8mil, smd to smd 8mil, copper to edge 40mil, drill to drill 8mil, minimum pad ring 10mil, minimum via ring 8mil, stop-mask expansion 4mil, vias tented up to drill 0mil, thermal gap 10mil

### Footprints (pad centres in the part's own frame; a part is rotated, then mirrored left to right if it is on the bottom)
0805 = smd 0.8 x 1.2: 1 -0.9,0; 2 0.9,0
1206 = smd 1.6 x 1.8: 1 -1.4,0; 2 1.4,0
COILCRAFT = smd 0.965 x 3.708: 1 -1.182,0; 2 1.182,0
2010 = smd 1.8 x 2.7: 1 -2.2,0; 2 2.2,0
QFN-36 = smd 0.24 x 0.5: P1 -3,-1.6; P2 -2.5,-1.6; P3 -2,-1.6; P4 -1.5,-1.6; P5 -1,-1.6; P6 -0.5,-1.6; P7 0,-1.6; P8 0.5,-1.6; P9 1,-1.6; P10 1.5,-1.6; P11 2,-1.6; P12 2.5,-1.6; P13 3,-1.6; P19 3,1.6; P20 2.5,1.6; P21 2,1.6; P22 1.5,1.6; P23 1,1.6; P24 0.5,1.6; P25 0,1.6; P26 -0.5,1.6; P27 -1,1.6; P28 -1.5,1.6; P29 -2,1.6; P30 -2.5,1.6; P31 -3,1.6 | smd 0.5 x 0.24: P14 3.35,-1; P15 3.35,-0.5; P16 3.35,0; P17 3.35,0.5; P18 3.35,1; P32 -3.35,1; P33 -3.35,0.5; P34 -3.35,0; P35 -3.35,-0.5; P36 -3.35,-1 | smd 1.514 x 2.25: P$37 -2.118,0 | smd 3.836 x 2.25: P$38 0.957,0
4X26_CONNECTOR_(V2.2) = drill 0.953 pad 1.88 octagon: P$1 -31.75,31.88; P$2 -31.75,34.42; P$3 -31.75,36.96; P$4 -31.75,39.5; P$5 -29.21,31.88; P$6 -29.21,34.42; P$7 -29.21,36.96; P$8 -29.21,39.5; P$9 -26.67,31.88; P$10 -26.67,34.42; P$11 -26.67,36.96; P$12 -26.67,39.5; P$13 -24.13,31.88; P$14 -24.13,34.42; P$15 -24.13,36.96; P$16 -24.13,39.5; P$17 -21.59,31.88; P$18 -21.59,34.42; P$19 -21.59,36.96; P$20 -21.59,39.5; P$21 -19.05,31.88; P$22 -19.05,34.42; P$23 -19.05,36.96; P$24 -19.05,39.5; P$25 -16.51,31.88; P$26 -16.51,34.42; P$27 -16.51,36.96; P$28 -16.51,39.5; P$29 -13.97,31.88; P$30 -13.97,34.42; P$31 -13.97,36.96; P$32 -13.97,39.5; P$33 -11.43,31.88; P$34 -11.43,34.42; P$35 -11.43,36.96; P$36 -11.43,39.5; P$37 -8.89,31.88; P$38 -8.89,34.42; P$39 -8.89,36.96; P$40 -8.89,39.5; P$41 -6.35,31.88; P$42 -6.35,34.42; P$43 -6.35,36.96; P$44 -6.35,39.5; P$45 -3.81,31.88; P$46 -3.81,34.42; P$47 -3.81,36.96; P$48 -3.81,39.5; P$49 -1.27,31.88; P$50 -1.27,34.42; P$51 -1.27,36.96; P$52 -1.27,39.5; P$53 1.27,31.88; P$54 1.27,34.42; P$55 1.27,36.96; P$56 1.27,39.5; P$57 3.81,31.88; P$58 3.81,34.42; P$59 3.81,36.96; P$60 3.81,39.5; P$61 6.35,31.88; P$62 6.35,34.42; P$63 6.35,36.96; P$64 6.35,39.5; P$65 8.89,31.88; P$66 8.89,34.42; P$67 8.89,36.96; P$68 8.89,39.5; P$69 11.43,31.88; P$70 11.43,34.42; P$71 11.43,36.96; P$72 11.43,39.5; P$73 13.97,31.88; P$74 13.97,34.42; P$75 13.97,36.96; P$76 13.97,39.5; P$77 16.51,31.88; P$78 16.51,34.42; P$79 16.51,36.96; P$80 16.51,39.5; P$81 19.05,31.88; P$82 19.05,34.42; P$83 19.05,36.96; P$84 19.05,39.5; P$85 21.59,31.88; P$86 21.59,34.42; P$87 21.59,36.96; P$88 21.59,39.5; P$89 24.13,31.88; P$90 24.13,34.42; P$91 24.13,36.96; P$92 24.13,39.5; P$93 26.67,31.88; P$94 26.67,34.42; P$95 26.67,36.96; P$96 26.67,39.5; P$97 29.21,31.88; P$98 29.21,34.42; P$99 29.21,36.96; P$100 29.21,39.5; P$101 31.75,31.88; P$102 31.75,34.42; P$103 31.75,36.96; P$104 31.75,39.5
BOARD_TEMPLATE_(V2.1) = drill 2.9 pad 7.5: P$1 -39.5,39.5; P$2 -39.5,-39.5; P$3 39.5,-39.5; P$4 39.5,39.5
2X10 = drill 1.016 pad 1.88 octagon: 1 -11.43,-1.27; 2 -11.43,1.27; 3 -8.89,-1.27; 4 -8.89,1.27; 5 -6.35,-1.27; 6 -6.35,1.27; 7 -3.81,-1.27; 8 -3.81,1.27; 9 -1.27,-1.27; 10 -1.27,1.27; 11 1.27,-1.27; 12 1.27,1.27; 13 3.81,-1.27; 14 3.81,1.27; 15 6.35,-1.27; 16 6.35,1.27; 17 8.89,-1.27; 18 8.89,1.27; 19 11.43,-1.27; 20 11.43,1.27
8-LFCSP = smd 0.6 x 0.24: P$1 -1.4,0.75; P$2 -1.4,0.25; P$3 -1.4,-0.25; P$4 -1.4,-0.75; P$5 1.4,-0.75; P$6 1.4,-0.25; P$7 1.4,0.25; P$8 1.4,0.75 | smd 1.6 x 2.44: P$9 0,0

### Placement (x,y rotation side)
C1  33.79,43.94 270 top
C2  43.03,43.94 270 top
C3  24.54,43.94 270 top
C4  52.18,43.94 270 top
C5  61.32,44.14 270 top
C6  70.46,43.94 270 top
C7  79.61,43.94 270 top
C8  88.96,43.94 270 top
C9  98.1,43.94 270 top
C10  30.78,68.58 0 top
C11  30.78,71.02 0 top
C12  40.18,72.54 270 top
C13  42.67,72.54 270 top
C14  54.97,68.38 0 top
C15  54.97,70.82 0 top
C16  64.36,72.34 270 top
C17  66.85,72.34 270 top
C_OUT  24.54,48.44 270 top
C_OUT1  33.79,48.44 270 top
C_OUT2  43.03,48.44 270 top
C_OUT3  52.18,48.44 270 top
C_OUT4  61.32,48.64 270 top
C_OUT5  70.46,48.44 270 top
C_OUT6  79.61,48.44 270 top
C_OUT7  88.96,48.44 270 top
C_OUT8  98.1,48.44 270 top
C_TIMER  29.29,40.44 270 top
C_TIMER1  38.54,40.44 270 top
C_TIMER2  47.78,40.44 270 top
C_TIMER3  56.93,40.44 270 top
C_TIMER4  66.07,40.64 270 top
C_TIMER5  75.21,40.44 270 top
C_TIMER6  84.36,40.44 270 top
C_TIMER7  93.71,40.44 270 top
C_TIMER8  102.85,40.44 270 top
CIN  25.6,69.7 180 top
CIN1  49.78,69.49 180 top
CSYNC  37.69,71.83 270 top
CSYNC1  61.87,71.63 270 top
L1  34.7,77.83 180 top
L2  58.88,77.62 180 top
R1  33.79,40.44 90 top
R2  43.03,40.44 90 top
R3  52.18,40.44 90 top
R4  61.32,40.64 90 top
R5  70.46,40.44 90 top
R6  79.61,40.44 90 top
R7  88.96,40.44 90 top
R8  98.1,40.44 90 top
R10  24.54,40.44 90 top
R_IMON  31.54,40.44 90 top
R_IMON1  40.79,40.44 90 top
R_IMON2  50.03,40.44 90 top
R_IMON3  59.18,40.44 90 top
R_IMON4  68.32,40.64 90 top
R_IMON5  77.46,40.44 90 top
R_IMON6  86.61,40.44 90 top
R_IMON7  95.96,40.44 90 top
R_IMON8  105.1,40.44 90 top
R_PROG  26.79,40.44 90 top
R_PROG1  36.04,40.44 90 top
R_PROG2  45.28,40.44 90 top
R_PROG3  54.43,40.44 90 top
R_PROG4  63.57,40.64 90 top
R_PROG5  72.71,40.44 90 top
R_PROG6  81.86,40.44 90 top
R_PROG7  91.21,40.44 90 top
R_PROG8  100.35,40.44 90 top
R_SENSE  28.04,55.94 270 top
R_SENSE1  37.29,55.94 270 top
R_SENSE2  46.53,55.94 270 top
R_SENSE3  55.68,55.94 270 top
R_SENSE4  64.82,56.14 270 top
R_SENSE5  73.96,55.94 270 top
R_SENSE6  83.11,55.94 270 top
R_SENSE7  92.46,55.94 270 top
R_SENSE8  101.6,55.94 270 top
R_SET  31.54,43.94 270 top
R_SET1  40.79,43.94 270 top
R_SET2  50.03,43.94 270 top
R_SET3  59.18,43.94 270 top
R_SET4  68.32,44.14 270 top
R_SET5  77.46,43.94 270 top
R_SET6  86.61,43.94 270 top
R_SET7  95.96,43.94 270 top
R_SET8  105.1,43.94 270 top
U$1  28.04,46.94 90 top
U$2  64.41,51.82 0 top
U$3  BOARD_TEMPLATE_(V2.1)  [BOARD_TEMPLATE_(V2.1)]  64.21,51.82 0 top
U$4  67.06,16.66 0 top
U$5  37.29,46.94 90 top
U$6  46.53,46.94 90 top
U$7  55.68,46.94 90 top
U$8  64.82,47.14 90 top
U$9  73.96,46.94 90 top
U$10  83.11,46.94 90 top
U$11  92.46,46.94 90 top
U$12  101.6,46.94 90 top
U$13  34.7,74.07 0 top
U$14  58.88,73.86 0 top

### Tracks (layer width: path | path; a pad name or v marks a point on that pad's centre or on a via)
3.3V_EN  (via drill 0.3)  (1 unrouted)
  Top 0.203: U$6.P33 46.03,43.39 45.31,42.67 44.37,42.67 R2.2 | 42.98,41.25 44.16,41.25 44.16,35.06 | 44.16,35.06 44.09,35.06 | v44.09,34.75 44.16,34.75 44.16,35.06
  Bottom 0.203: 44.3,34.75 v44.09,34.75 | v44.09,34.75 44.5,34.75 | v44.09,34.75 44.09,32.82 59.64,32.82 59.54,15.44 60.71,15.44 U$4.5
3.3V_IMON  (1 unrouted)
  Top 0.203: U$6.P2 48.53,44.44 48.78,44.19 48.78,42.44 48.93,42.44 R_IMON2.2 | 50.03,41.31 49.03,41.31 49.03,35.36 | 49.03,35.36 49.03,35.19 | 49.03,35.36 49.07,35.36 | 49.03,35.19 48.97,35.19 | 49.03,35.19 49.07,35.19 49.07,33.32 60.71,33.32 U$4.6 | 49.03,35.19 49.03,35.36
3.3V_VOUT  (via drill 0.3)
  Bottom 0.203: U$2.P$54 64.62,86.24 64.62,86.16 64.41,86.16 64.41,81.69 70.51,81.69 70.51,63.6 v49.17,63.6
  pour Top (isolate 0.25, rank 2, no thermals): 43.53,46.33 49.53,46.33 49.53,63.94 48.53,63.94 48.53,56.94 43.53,56.94
3.3VBUCK_EN  (via drill 0.3)
  Top 0.203: U$14.P$3 56.49,73.61 56.49,73.15 v55.47,73.15 | v49.17,73.15 v49.17,79.45 | v49.17,80.87 71.93,80.87 v71.93,81.28
  Bottom 0.203: v49.17,73.15 48.97,72.95 55.47,72.95 v55.47,73.15 | v49.17,79.45 v49.17,80.87 | v71.93,81.28 107.09,81.28 107.09,30.89 78.49,30.89 U$4.20
3.3VBUCK_OUT  (via drill 0.3)  (2 unrouted)
  Top 0.203: U$14.P$5 60.76,73.11 60.76,71.83 62.99,71.83 62.99,74.17 64.36,74.17 C16.1 C17.1 | U$6.P29 43.93,44.94 C2.1 | R_SET2.2 50.1,43.15 v50.01,43.41 | v42.53,45.52 42.53,44.94 | 59.94,80.26 45.72,80.26 45.72,64.62 46.53,64.62 46.53,63.8
  Bottom 0.203: v50.01,43.41 50.53,45.52 | 50.53,45.52 50.53,56.44 46.53,56.44 v46.53,57.44 | 50.53,45.52 v42.53,45.52
  pour Top (rank 4, no thermals): 59.13,75.79 59.33,80.67 68.68,80.67 68.48,72.14 63.2,72.34
  pour Top (rank 3, no thermals): 45.53,58.44 47.53,58.44 47.53,64.06 45.53,64.06
5V_EN  (via drill 0.3)  (1 unrouted)
  Top 0.203: U$5.P33 36.79,43.39 36.07,42.67 35.12,42.67 R1.2 | 33.73,41.25 34.91,41.25 34.91,35.06 | 34.91,35.06 34.85,35.06 | v34.85,34.75 34.91,34.75 34.91,35.06
  Bottom 0.203: 35.05,34.75 v34.85,34.75 34.95,34.75 34.95,32.31 56.9,32.31 56.9,15.44 58.17,15.44 U$4.3
5V_IMON  (1 unrouted)
  Top 0.203: U$5.P2 39.29,44.44 39.54,44.19 39.54,42.44 39.69,42.44 R_IMON1.2 | 40.79,41.31 39.79,41.31 39.79,35.36 | 39.79,35.36 39.83,35.36 | 39.79,35.19 39.73,35.19 | 39.79,35.19 39.83,35.19 39.83,32.82 58.17,32.82 U$4.4 | 39.79,35.19 39.79,35.36
5V_VOUT  (via drill 0.3)
  Bottom 0.203: 63.2,86.24 U$2.P$50 61.98,86.24 61.98,81.79 45.72,81.79 45.72,64.62 39.83,64.62 v39.83,63.6
  pour Top (isolate 0.25, rank 2, no thermals): 34.29,46.33 40.29,46.33 40.29,63.94 39.29,63.94 39.29,56.94 34.29,56.94
5VBUCK_EN  (via drill 0.3)
  Top 0.203: U$13.P$3 32.31,73.82 32.31,73.35 v31.29,73.35
  Bottom 0.203: v31.29,73.35 31.29,73.15 24.79,73.15 v24.99,73.35 21.54,73.35 21.54,30.07 53.24,30.07 53.24,13 78.64,13 78.49,13 U$4.19
5VBUCK_OUT  (via drill 0.3)  (1 unrouted)
  Top 0.203: 40.85,43.15 R_SET1.2 40.79,43.38 v40.74,43.38 | v33.32,45.52 33.32,44.84 C1.1 34.54,44.84 34.54,44.91 35.69,44.91 U$5.P29 | U$13.P$5 36.58,73.32 36.58,72.03 | 36.58,72.03 38.81,72.03 38.81,74.37 40.18,74.37 C12.1 C13.1 | 36.58,72.03 35.97,72.03 35.97,64.82 37.19,64.82 v37.19,57.3
  Bottom 0.203: v37.19,57.3 37.19,56.49 41.25,56.49 41.25,45.52 40.74,45.52 | 40.74,45.52 v40.74,43.38 | 40.74,45.52 v33.32,45.52
  pour Top (rank 4, no thermals): 34.95,76 35.15,80.87 44.5,80.87 44.3,72.34 39.01,72.54
  pour Top (rank 3, no thermals): 36.29,58.44 38.29,58.44 38.29,64.06 36.29,64.06
ADCS2_EN  (via drill 0.3)  (1 unrouted)
  Top 0.203: U$8.P33 64.32,43.59 63.6,42.87 62.65,42.87 R4.2 | 61.26,41.45 62.45,41.45 62.45,35.27 | 62.45,35.27 62.38,35.27 | v62.38,34.95 62.45,34.95 62.45,35.27
  Bottom 0.203: 62.59,34.95 v62.38,34.95 | v62.38,34.95 62.79,34.95 | U$4.9 65.79,15.34 64.52,15.34 64.52,33.83 62.38,33.83 v62.38,34.95
ADCS2_IMON  (1 unrouted)
  Top 0.203: U$8.P2 66.82,44.64 67.07,44.39 67.07,42.64 67.22,42.64 R_IMON4.2 | 68.32,41.52 67.32,41.52 67.32,35.56 | 67.32,35.56 67.32,35.39 | 67.32,35.56 67.36,35.56 | 67.32,35.39 67.36,35.39 | 67.32,35.39 67.26,35.39 | 67.32,35.39 67.26,35.39 | 67.26,35.39 67.26,33.93 65.79,33.93 U$4.10 | 67.32,35.39 67.32,35.56
ADCS2_VOUT  (via drill 0.3)
  Top 0.203: U$2.P$81 83.11,83.7 83.11,68.68 71.73,68.68 71.73,63.4 67.46,63.4 v67.46,63.8
  pour Top (isolate 0.25, rank 2, no thermals): 61.82,46.53 67.82,46.53 67.82,64.14 66.82,64.14 66.82,57.14 61.82,57.14
BOOT_EN
  Top 0.203: U$9.P33 73.46,43.39 72.75,42.67 71.8,42.67 R5.2
BOOT_IMON
  Top 0.203: U$9.P2 75.96,44.44 76.21,44.19 76.21,42.44 76.36,42.44 R_IMON5.2
BOOT_VOUT  (via drill 0.3)
  Top 0.203: U$2.P$85 86.16,83.7 86.16,67.46 76.61,67.46 v76.61,63.6
  pour Top (isolate 0.25, rank 2, no thermals): 70.96,46.33 76.96,46.33 76.96,63.94 75.96,63.94 75.96,56.94 70.96,56.94
COM1_EN  (via drill 0.3)  (1 unrouted)
  Top 0.203: U$12.P33 101.1,43.39 100.38,42.67 99.43,42.67 R8.2 | 98.04,41.25 99.23,41.25 99.23,35.06 | 99.23,35.06 99.16,35.06 | v99.16,34.75 99.23,34.75 99.23,35.06
  Bottom 0.203: 99.36,34.75 v99.16,34.75 | v99.16,34.75 99.57,34.75 | v99.16,34.75 99.16,32 74.68,32 74.68,15.24 75.95,15.24 U$4.17
COM1_IMON
  Top 0.203: U$12.P2 103.6,44.44 103.85,44.19 103.85,42.44 104,42.44 R_IMON8.2
COM1_VOUT  (via drill 0.3)
  Top 0.203: U$2.P$101 96.32,83.7 96.32,67.06 104.24,67.06 v104.24,63.6
  pour Top (isolate 0.25, rank 2, no thermals): 98.6,46.33 104.6,46.33 104.6,63.94 103.6,63.94 103.6,56.94 98.6,56.94
COM2_EN
  Top 0.203: U$11.P33 91.96,43.39 91.24,42.67 90.29,42.67 R7.2
COM2_IMON  (1 unrouted)
  Top 0.203: U$11.P2 94.46,44.44 94.71,44.19 94.71,42.44 94.86,42.44 R_IMON7.2 | 95.96,41.31 94.96,41.31 94.96,35.36 | 94.96,35.36 94.96,35.19 | 94.96,35.36 95,35.36 | 94.96,35.19 95,35.19 | 94.96,35.19 94.89,35.19 | 94.96,35.19 94.89,35.19 | 94.89,35.19 94.89,32.51 73.41,32.51 U$4.16 | 94.96,35.19 94.96,35.36
COM2_VOUT  (via drill 0.3)
  Top 0.203: U$2.P$97 95.1,83.7 v95.1,63.6
  pour Top (isolate 0.25, rank 2, no thermals): 89.46,46.33 95.46,46.33 95.46,63.94 94.46,63.94 94.46,56.94 89.46,56.94
DRAIN  (via drill 0.3)  (1 unrouted)
  Top 0.203: U$1.P27 27.79,45.94 28.04,46.19 | 28.04,46.19 U$1.P$38 | U$1.P5 28.29,45.94 28.04,46.19
  other vias: 27.33,46.63 28.04,46.63 28.75,46.63 27.33,47.35 28.04,47.35 28.75,47.35 28.75,48.06 28.75,48.77 28.04,48.77 28.04,48.06 27.33,48.06 27.33,48.77 27.33,49.48 28.04,49.48 28.75,49.48 28.75,50.9 27.33,50.9 28.04,50.9 28.04,51.61 28.04,52.32 28.75,51.61 28.75,52.32 28.75,53.04 28.04,53.04 27.33,53.04 27.33,52.32 27.33,51.61
  pour Bottom: 26.04,54.44 26.04,46.44 31.54,46.44 31.54,54.44
  pour Top (no thermals): 27.04,48.94 27.04,53.94 29.04,53.94 29.04,48.94
DRAIN1  (via drill 0.3)  (1 unrouted)
  Top 0.203: U$5.P27 37.04,45.94 37.29,46.19 | 37.29,46.19 U$5.P$38 | U$5.P5 37.54,45.94 37.29,46.19
  other vias: 36.58,46.63 37.29,46.63 38,46.63 36.58,47.35 37.29,47.35 38,47.35 38,48.06 38,48.77 37.29,48.77 37.29,48.06 36.58,48.06 36.58,48.77 36.58,49.48 37.29,49.48 38,49.48 38,50.9 36.58,50.9 37.29,50.9 37.29,51.61 37.29,52.32 38,51.61 38,52.32 38,53.04 37.29,53.04 36.58,53.04 36.58,52.32 36.58,51.61
  pour Bottom: 35.29,54.44 35.29,46.44 40.79,46.44 40.79,54.44
  pour Top (no thermals): 36.29,48.94 36.29,53.94 38.29,53.94 38.29,48.94
DRAIN2  (via drill 0.3)  (1 unrouted)
  Top 0.203: U$6.P27 46.28,45.94 46.53,46.19 | 46.53,46.19 U$6.P$38 | U$6.P5 46.78,45.94 46.53,46.19
  other vias: 45.82,46.63 46.53,46.63 47.24,46.63 45.82,47.35 46.53,47.35 47.24,47.35 47.24,48.06 47.24,48.77 46.53,48.77 46.53,48.06 45.82,48.06 45.82,48.77 45.82,49.48 46.53,49.48 47.24,49.48 47.24,50.9 45.82,50.9 46.53,50.9 46.53,51.61 46.53,52.32 47.24,51.61 47.24,52.32 47.24,53.04 46.53,53.04 45.82,53.04 45.82,52.32 45.82,51.61
  pour Bottom: 44.53,54.44 44.53,46.44 50.03,46.44 50.03,54.44
  pour Top (no thermals): 45.53,48.94 45.53,53.94 47.53,53.94 47.53,48.94
DRAIN3  (via drill 0.3)  (1 unrouted)
  Top 0.203: U$7.P27 55.43,45.94 55.68,46.19 | 55.68,46.19 U$7.P$38 | U$7.P5 55.93,45.94 55.68,46.19
  other vias: 54.97,46.63 55.68,46.63 56.39,46.63 54.97,47.35 55.68,47.35 56.39,47.35 56.39,48.06 56.39,48.77 55.68,48.77 55.68,48.06 54.97,48.06 54.97,48.77 54.97,49.48 55.68,49.48 56.39,49.48 56.39,50.9 54.97,50.9 55.68,50.9 55.68,51.61 55.68,52.32 56.39,51.61 56.39,52.32 56.39,53.04 55.68,53.04 54.97,53.04 54.97,52.32 54.97,51.61
  pour Bottom: 53.68,54.44 53.68,46.44 59.18,46.44 59.18,54.44
  pour Top (no thermals): 54.68,48.94 54.68,53.94 56.68,53.94 56.68,48.94
DRAIN4  (via drill 0.3)  (1 unrouted)
  Top 0.203: U$8.P27 64.57,46.14 64.82,46.39 | 64.82,46.39 U$8.P$38 | U$8.P5 65.07,46.14 64.82,46.39
  other vias: 64.11,46.84 64.82,46.84 65.53,46.84 64.11,47.55 64.82,47.55 65.53,47.55 65.53,48.26 65.53,48.97 64.82,48.97 64.82,48.26 64.11,48.26 64.11,48.97 64.11,49.68 64.82,49.68 65.53,49.68 65.53,51.1 64.11,51.1 64.82,51.1 64.82,51.82 64.82,52.53 65.53,51.82 65.53,52.53 65.53,53.24 64.82,53.24 64.11,53.24 64.11,52.53 64.11,51.82
  pour Bottom: 62.82,54.64 62.82,46.64 68.32,46.64 68.32,54.64
  pour Top (no thermals): 63.82,49.14 63.82,54.14 65.82,54.14 65.82,49.14
DRAIN5  (via drill 0.3)  (1 unrouted)
  Top 0.203: U$9.P27 73.71,45.94 73.96,46.19 | 73.96,46.19 U$9.P$38 | U$9.P5 74.21,45.94 73.96,46.19
  other vias: 73.25,46.63 73.96,46.63 74.68,46.63 73.25,47.35 73.96,47.35 74.68,47.35 74.68,48.06 74.68,48.77 73.96,48.77 73.96,48.06 73.25,48.06 73.25,48.77 73.25,49.48 73.96,49.48 74.68,49.48 74.68,50.9 73.25,50.9 73.96,50.9 73.96,51.61 73.96,52.32 74.68,51.61 74.68,52.32 74.68,53.04 73.96,53.04 73.25,53.04 73.25,52.32 73.25,51.61
  pour Bottom: 71.96,54.44 71.96,46.44 77.46,46.44 77.46,54.44
  pour Top (no thermals): 72.96,48.94 72.96,53.94 74.96,53.94 74.96,48.94
DRAIN6  (via drill 0.3)  (1 unrouted)
  Top 0.203: U$10.P27 82.86,45.94 83.11,46.19 | 83.11,46.19 U$10.P$38 | U$10.P5 83.36,45.94 83.11,46.19
  other vias: 82.4,46.63 83.11,46.63 83.82,46.63 82.4,47.35 83.11,47.35 83.82,47.35 83.82,48.06 83.82,48.77 83.11,48.77 83.11,48.06 82.4,48.06 82.4,48.77 82.4,49.48 83.11,49.48 83.82,49.48 83.82,50.9 82.4,50.9 83.11,50.9 83.11,51.61 83.11,52.32 83.82,51.61 83.82,52.32 83.82,53.04 83.11,53.04 82.4,53.04 82.4,52.32 82.4,51.61
  pour Bottom: 81.11,54.44 81.11,46.44 86.61,46.44 86.61,54.44
  pour Top (no thermals): 82.11,48.94 82.11,53.94 84.11,53.94 84.11,48.94
DRAIN7  (via drill 0.3)  (1 unrouted)
  Top 0.203: U$11.P27 92.21,45.94 92.46,46.19 | 92.46,46.19 U$11.P$38 | U$11.P5 92.71,45.94 92.46,46.19
  other vias: 91.74,46.63 92.46,46.63 93.17,46.63 91.74,47.35 92.46,47.35 93.17,47.35 93.17,48.06 93.17,48.77 92.46,48.77 92.46,48.06 91.74,48.06 91.74,48.77 91.74,49.48 92.46,49.48 93.17,49.48 93.17,50.9 91.74,50.9 92.46,50.9 92.46,51.61 92.46,52.32 93.17,51.61 93.17,52.32 93.17,53.04 92.46,53.04 91.74,53.04 91.74,52.32 91.74,51.61
  pour Bottom: 90.46,54.44 90.46,46.44 95.96,46.44 95.96,54.44
  pour Top (no thermals): 91.46,48.94 91.46,53.94 93.46,53.94 93.46,48.94
DRAIN8  (via drill 0.3)  (1 unrouted)
  Top 0.203: U$12.P27 101.35,45.94 101.6,46.19 | 101.6,46.19 U$12.P$38 | U$12.P5 101.85,45.94 101.6,46.19
  other vias: 100.89,46.63 101.6,46.63 102.31,46.63 100.89,47.35 101.6,47.35 102.31,47.35 102.31,48.06 102.31,48.77 101.6,48.77 101.6,48.06 100.89,48.06 100.89,48.77 100.89,49.48 101.6,49.48 102.31,49.48 102.31,50.9 100.89,50.9 101.6,50.9 101.6,51.61 101.6,52.32 102.31,51.61 102.31,52.32 102.31,53.04 101.6,53.04 100.89,53.04 100.89,52.32 100.89,51.61
  pour Bottom: 99.6,54.44 99.6,46.44 105.1,46.44 105.1,54.44
  pour Top (no thermals): 100.6,48.94 100.6,53.94 102.6,53.94 102.6,48.94
ESTIMAT_EN  (via drill 0.3)  (1 unrouted)
  Top 0.203: U$7.P33 55.18,43.39 54.46,42.67 53.51,42.67 R3.2 | 52.12,41.25 53.3,41.25 53.3,35.06 | 53.3,35.06 53.24,35.06 | v53.24,34.75 53.3,34.75 53.3,35.06
  Bottom 0.203: 53.44,34.75 v53.24,34.75 | v53.24,34.75 53.64,34.75 | v53.24,34.75 53.24,33.32 61.98,33.32 61.98,15.44 63.25,15.44 U$4.7
ESTIMAT_IMON  (1 unrouted)
  Top 0.203: U$7.P2 57.68,44.44 57.93,44.19 57.93,42.44 58.08,42.44 R_IMON3.2 | 59.18,41.31 58.18,41.31 58.18,35.36 | 58.18,35.36 58.18,35.19 | 58.18,35.36 58.22,35.36 | 58.18,35.19 58.12,35.19 | 58.18,35.19 58.22,35.19 58.22,33.83 63.25,33.83 U$4.8 | 58.18,35.19 58.18,35.36
ESTIMAT_VOUT  (via drill 0.3)
  Top 0.203: U$2.P$77 81.08,83.7 81.08,70.92 70.31,70.92 70.31,64.82 58.32,64.82 v58.32,63.6
  pour Top (isolate 0.25, rank 2, no thermals): 52.68,46.33 58.68,46.33 58.68,63.94 57.68,63.94 57.68,56.94 52.68,56.94
GND  (via drill 0.3, 0.3 pad 0.3, 0.6)  (31 unrouted)
  Top 0.203: U$1.P28 27.54,45.44 | U$1.P36 29.04,43.82 U$1.P$37 28.66,45.44 U$1.P4 | v24.55,42.53 24.55,42.94 C3.2 24.58,43.08 26.62,43.08 27.04,43.5 U$1.P32 27.04,44.69 | U$1.P1 29.21,43.94 29.01,44.14 | R10.1 24.54,38.65 v24.59,38.81 | R_PROG.1 26.79,38.84 v26.77,38.81 | C_TIMER.2 29.29,38.98 v29.31,38.81 | R_IMON.1 31.54,38.97 v31.55,38.81 | C_OUT.2 v24.52,46.84 | U$5.P28 36.79,45.44 | U$5.P36 38.29,43.82 U$5.P$37 37.91,45.44 U$5.P4 | v33.8,42.53 33.79,42.94 C1.2 33.83,43.08 35.86,43.08 36.29,43.5 U$5.P32 36.29,44.69 | U$5.P1 38.46,43.94 38.25,44.14 | R1.1 33.79,38.65 v33.83,38.81 | R_PROG1.1 36.04,38.84 v36.02,38.81 | C_TIMER1.2 38.54,38.98 v38.56,38.81 | R_IMON1.1 40.79,38.97 v40.79,38.81 | C_OUT1.2 v33.76,46.84 | U$6.P28 46.03,45.44 | U$6.P36 47.53,43.82 U$6.P$37 47.15,45.44 U$6.P4 | v43.04,42.53 43.04,42.94 C2.2 43.07,43.08 45.11,43.08 45.53,43.5 U$6.P32 45.53,44.69 | U$6.P1 47.7,43.94 47.5,44.14 | R2.1 43.03,38.65 v43.08,38.81 | R_PROG2.1 45.28,38.84 v45.26,38.81 | C_TIMER2.2 47.78,38.98 v47.8,38.81 | R_IMON2.1 50.03,38.97 v50.04,38.81 | C_OUT2.2 v43.01,46.84 | U$7.P28 55.18,45.44 | U$7.P36 56.68,43.82 U$7.P$37 56.29,45.44 U$7.P4 | v52.19,42.53 52.18,42.94 C4.2 52.22,43.08 54.25,43.08 54.68,43.5 U$7.P32 54.68,44.69 | U$7.P1 56.85,43.94 56.64,44.14 | R3.1 52.18,38.65 v52.22,38.81 | R_PROG3.1 54.43,38.84 v54.41,38.81 | C_TIMER3.2 56.93,38.98 v56.95,38.81 | R_IMON3.1 59.18,38.97 v59.18,38.81 | C_OUT3.2 v52.15,46.84 | U$8.P28 64.32,45.64 | U$8.P36 65.82,44.02 U$8.P$37 65.44,45.64 U$8.P4 | v61.33,42.74 61.33,43.14 C5.2 61.36,43.28 63.4,43.28 63.82,43.7 U$8.P32 63.82,44.89 | U$8.P1 65.99,44.14 65.79,44.35
  Top 0.203: R4.1 61.32,38.86 v61.37,39.01 | R_PROG4.1 63.57,39.04 v63.55,39.01 | C_TIMER4.2 66.07,39.19 v66.09,39.01 | R_IMON4.1 68.32,39.17 v68.33,39.01 | C_OUT4.2 v61.3,47.04 | U$9.P28 73.46,45.44 | U$9.P36 74.96,43.82 U$9.P$37 74.58,45.44 U$9.P4 | v70.48,42.53 70.47,42.94 C6.2 70.5,43.08 72.54,43.08 72.96,43.5 U$9.P32 72.96,44.69 | U$9.P1 75.14,43.94 74.93,44.14 | R5.1 70.46,38.65 v70.51,38.81 | R_PROG5.1 72.71,38.84 v72.69,38.81 | C_TIMER5.2 75.21,38.98 v75.23,38.81 | R_IMON5.1 77.46,38.97 v77.47,38.81 | C_OUT5.2 v70.44,46.84 | U$10.P28 82.61,45.44 | U$10.P36 84.11,43.82 U$10.P$37 83.73,45.44 U$10.P4 | v79.62,42.53 79.61,42.94 C7.2 79.65,43.08 81.69,43.08 82.11,43.5 U$10.P32 82.11,44.69 | U$10.P1 84.28,43.94 84.07,44.14 | R6.1 79.61,38.65 v79.65,38.81 | R_PROG6.1 81.86,38.84 v81.84,38.81 | C_TIMER6.2 84.36,38.98 v84.38,38.81 | R_IMON6.1 86.61,38.97 v86.61,38.81 | C_OUT6.2 v79.59,46.84 | U$11.P28 91.96,45.44 | U$11.P36 93.46,43.82 U$11.P$37 93.07,45.44 U$11.P4 | v88.97,42.53 88.96,42.94 C8.2 89,43.08 91.03,43.08 91.46,43.5 U$11.P32 91.46,44.69 | U$11.P1 93.63,43.94 93.42,44.14 | R7.1 88.96,38.65 v89,38.81 | R_PROG7.1 91.21,38.84 v91.19,38.81 | C_TIMER7.2 93.71,38.98 v93.73,38.81 | R_IMON7.1 95.96,38.97 v95.96,38.81 | C_OUT7.2 v88.93,46.84 | U$12.P28 101.1,45.44 | U$12.P36 102.6,43.82 U$12.P$37 102.22,45.44 U$12.P4 | v98.11,42.53 98.11,42.94 C9.2 98.14,43.08 100.18,43.08 100.6,43.5 U$12.P32 100.6,44.69 | U$12.P1 102.77,43.94 102.57,44.14 | R8.1 98.1,38.65 v98.15,38.81 | R_PROG8.1 100.35,38.84 v100.33,38.81 | C_TIMER8.2 102.85,38.98 v102.87,38.81 | R_IMON8.1 105.1,38.97 v105.11,38.81 | C_OUT8.2 v98.08,46.84
  Top 0.203: U$13.P$8 35.1,74.82 | U$14.P$8 59.28,74.61
  Top 0.406: 35.1,74.82 v35.1,74.88 | U$13.P$9 35.1,74.07 35.1,71.73 34.29,71.73 v34.29,73.25 | v22.56,69.7 24.18,69.7 | 59.28,74.61 v59.28,74.68 | U$14.P$9 59.28,73.86 59.28,71.53 58.47,71.53 v58.47,73.05 | v46.74,69.49 48.36,69.49
  Bottom 0.203: v24.55,42.53 24.5,42.88 | v24.59,38.81 24.38,38.61 | v26.77,38.81 26.82,38.61 | v29.31,38.81 29.46,37.79 29.26,37.59 | v31.55,38.81 31.5,38.61 | v24.52,46.84 24.79,45.94 | v33.8,42.53 33.74,42.88 | v33.83,38.81 33.63,38.61 | v36.02,38.81 36.07,38.61 | v38.56,38.81 38.71,37.79 38.51,37.59 | v40.79,38.81 40.74,38.61 | v33.76,46.84 34.04,45.94 | v43.04,42.53 42.99,42.88 | v43.08,38.81 42.88,38.61 | v45.26,38.81 45.31,38.61 | v47.8,38.81 47.96,37.79 47.75,37.59 | v50.04,38.81 49.99,38.61 | v43.01,46.84 43.28,45.94 | v52.19,42.53 52.13,42.88 | v52.22,38.81 52.02,38.61 | v54.41,38.81 54.46,38.61 | v56.95,38.81 57.1,37.79 56.9,37.59 | v59.18,38.81 59.13,38.61 | v52.15,46.84 52.43,45.94 | v61.33,42.74 61.28,43.09 | v61.37,39.01 61.16,38.81 | v63.55,39.01 63.6,38.81 | v66.09,39.01 66.24,38 66.04,37.79 | v68.33,39.01 68.28,38.81 | v61.3,47.04 61.57,46.14 | v70.48,42.53 70.42,42.88 | v70.51,38.81 70.31,38.61 | v72.69,38.81 72.75,38.61 | v75.23,38.81 75.39,37.79 75.18,37.59 | v77.47,38.81 77.42,38.61 | v70.44,46.84 70.71,45.94 | v79.62,42.53 79.57,42.88 | v79.65,38.81 79.45,38.61 | v81.84,38.81 81.89,38.61 | v84.38,38.81 84.53,37.79 84.33,37.59 | v86.61,38.81 86.56,38.61 | v79.59,46.84 79.86,45.94 | v88.97,42.53 88.91,42.88 | v89,38.81 88.8,38.61 | v91.19,38.81 91.24,38.61 | v93.73,38.81 93.88,37.79 93.68,37.59 | v95.96,38.81 95.91,38.61 | v88.93,46.84 89.21,45.94 | v98.11,42.53 98.06,42.88 | v98.15,38.81 97.94,38.61 | v100.33,38.81 100.38,38.61 | v102.87,38.81 103.02,37.79 102.82,37.59 | v105.11,38.81 105.05,38.61 | v98.08,46.84 98.35,45.94
  Bottom 0.406: v34.29,73.25 34.34,73.25 34.34,71.73 35.1,71.73 v35.1,73.25 | v22.56,69.7 23.37,69.7 | v58.47,73.05 58.52,73.05 58.52,71.53 59.28,71.53 v59.28,73.05 | v46.74,69.49 47.55,69.49
  other vias: 27.64,44.44 27.28,44.89 28.04,44.89 28.8,44.89 28.4,44.44 36.88,44.44 36.53,44.89 37.29,44.89 38.05,44.89 37.64,44.44 46.13,44.44 45.77,44.89 46.53,44.89 47.29,44.89 46.89,44.44 55.27,44.44 54.91,44.89 55.68,44.89 56.44,44.89 56.03,44.44 64.41,44.64 64.06,45.1 64.82,45.1 65.58,45.1 65.18,44.64 73.56,44.44 73.2,44.89 73.96,44.89 74.73,44.89 74.32,44.44 82.7,44.44 82.35,44.89 83.11,44.89 83.87,44.89 83.46,44.44 92.05,44.44 91.69,44.89 92.46,44.89 93.22,44.89 92.81,44.44 101.19,44.44 100.84,44.89 101.6,44.89 102.36,44.89 101.96,44.44 34.29,74.88 35.15,68.88 33.12,70.92 33.12,68.48 37.59,70.31 40.23,70.1 42.67,69.9 58.47,74.68 59.33,68.68 57.3,70.71 57.3,68.28 61.77,70.1 64.41,69.9 66.85,69.7
  pour Bottom: 22.52,46.62 34.01,46.62 34.01,34.26 22.52,34.26
  pour Bottom: 31.77,46.62 43.25,46.62 43.25,34.26 31.77,34.26
  pour Bottom: 41.01,46.62 52.5,46.62 52.5,34.26 41.01,34.26
  pour Bottom: 50.16,46.62 61.64,46.62 61.64,34.26 50.16,34.26
  pour Bottom: 59.3,46.82 70.79,46.82 70.79,34.47 59.3,34.47
  pour Bottom: 68.44,46.62 79.93,46.62 79.93,34.26 68.44,34.26
  pour Bottom: 77.59,46.62 89.07,46.62 89.07,34.26 77.59,34.26
  pour Bottom: 86.93,46.62 98.42,46.62 98.42,34.26 86.93,34.26
  pour Bottom: 96.08,46.62 107.57,46.62 107.57,34.26 96.08,34.26
  pour Top (rank 3, no thermals): 29.46,72.34 44.3,72.34 44.3,66.04 29.26,65.84
  pour Bottom (no thermals): 21.95,81.28 21.95,65.43 44.91,65.43 44.91,81.28
  pour Top (rank 3, no thermals): 53.64,72.14 68.48,72.14 68.48,65.84 53.44,65.63
  pour Bottom (no thermals): 46.13,81.08 46.13,65.23 69.09,65.23 69.09,81.08
INPUT6_EN  (via drill 0.3)
  Top 0.203: 70.41,41.25 71.59,41.25 71.59,35.06 | 71.59,35.06 71.53,35.06 | v71.53,34.75 71.59,34.75 71.59,35.06
  Bottom 0.203: 71.73,34.75 v71.53,34.75 | v71.53,34.75 71.93,34.75 | v71.53,34.75 71.53,33.53 67.06,33.53 67.06,15.24 68.33,15.24 U$4.11
INPUT6_IMON
  Top 0.203: 77.46,41.31 76.46,41.31 76.46,35.36 | 76.46,35.36 76.46,35.19 | 76.46,35.36 76.5,35.36 | 76.46,35.19 76.4,35.19 | 76.5,35.19 76.46,35.19 | 76.46,35.19 76.4,35.19 | 76.4,35.19 76.4,33.53 68.33,33.53 U$4.12 | 76.46,35.19 76.46,35.36
INPUT8_EN  (via drill 0.3)
  Top 0.203: 88.9,41.25 90.08,41.25 90.08,35.06 | 90.08,35.06 90.02,35.06 | v90.02,34.75 90.08,34.75 90.08,35.06
  Bottom 0.203: 90.22,34.75 v90.02,34.75 | v90.02,34.75 90.42,34.75 | v90.02,34.75 90.02,32.51 72.14,32.51 72.14,15.44 73.41,15.44 U$4.15
INPUT9_IMON
  Top 0.203: 105.1,41.31 104.1,41.31 104.1,35.36 | 104.1,35.36 104.1,35.19 | 104.1,35.36 104.14,35.36 | 104.1,35.19 104.14,35.19 | 104.1,35.19 104.04,35.19 104.04,32 75.95,32 U$4.18 | 104.1,35.19 104.1,35.36
MODE
  Top 0.203: CSYNC.1 37.69,74.32 U$13.P$7 U$13.P$6
MODE1
  Top 0.203: CSYNC1.1 61.87,74.11 U$14.P$7 U$14.P$6
N$2  (via drill 0.3)
  Top 0.203: 26.54,46.44 25.7,46.43 25.57,46.29 v25.57,46.21
  Bottom 0.203: v25.57,46.21 25.54,45.94 31.54,45.94 31.54,55.94 28.04,55.94 v28.04,54.44 28.04,54.35
N$3  (via drill 0.3)
  Top 0.203: 35.79,46.44 34.95,46.43 34.81,46.29 v34.81,46.21
  Bottom 0.203: v34.81,46.21 34.79,45.94 40.79,45.94 40.79,55.94 37.29,55.94 v37.29,54.44 37.29,54.35
N$10  (via drill 0.3)
  Top 0.203: 45.03,46.44 44.2,46.43 44.06,46.29 v44.06,46.21
  Bottom 0.203: v44.06,46.21 44.03,45.94 50.03,45.94 50.03,55.94 46.53,55.94 v46.53,54.44 46.53,54.35
N$11  (via drill 0.3)
  Top 0.203: 54.18,46.44 53.34,46.43 53.2,46.29 v53.2,46.21
  Bottom 0.203: v53.2,46.21 53.18,45.94 59.18,45.94 59.18,55.94 55.68,55.94 v55.68,54.44 55.68,54.35
N$12  (via drill 0.3)
  Top 0.203: 63.32,46.64 62.48,46.63 62.35,46.5 v62.35,46.41
  Bottom 0.203: v62.35,46.41 62.32,46.14 68.32,46.14 68.32,56.14 64.82,56.14 v64.82,54.64 64.82,54.56
N$13  (via drill 0.3)
  Top 0.203: 72.46,46.44 71.63,46.43 71.49,46.29 v71.49,46.21
  Bottom 0.203: v71.49,46.21 71.46,45.94 77.46,45.94 77.46,55.94 73.96,55.94 v73.96,54.44 73.96,54.35
N$14  (via drill 0.3)
  Top 0.203: 81.61,46.44 80.77,46.43 80.63,46.29 v80.63,46.21
  Bottom 0.203: v80.63,46.21 80.61,45.94 86.61,45.94 86.61,55.94 83.11,55.94 v83.11,54.44 83.11,54.35
N$15  (via drill 0.3)
  Top 0.203: 90.96,46.44 90.12,46.43 89.98,46.29 v89.98,46.21
  Bottom 0.203: v89.98,46.21 89.96,45.94 95.96,45.94 95.96,55.94 92.46,55.94 v92.46,54.44 92.46,54.35
N$16  (via drill 0.3)
  Top 0.203: 100.1,46.44 99.26,46.43 99.13,46.29 v99.13,46.21
  Bottom 0.203: v99.13,46.21 99.1,45.94 105.1,45.94 105.1,55.94 101.6,55.94 v101.6,54.44 101.6,54.35
PPT_EN  (via drill 0.3)  (3 unrouted)
  Top 0.203: U$1.P33 27.54,43.39 26.82,42.67 25.87,42.67 R10.2 | 24.49,41.25 25.67,41.25 25.67,35.06 25.6,35.06
  Bottom 0.203: v25.7,35.05 25.81,35.05 25.81,31.7 54.25,31.7 54.25,15.44 55.68,15.44
PPT_IMON  (2 unrouted)
  Top 0.203: U$1.P2 30.04,44.44 30.29,44.19 30.29,42.44 30.44,42.44 R_IMON.2 | 31.54,41.31 30.54,41.31 30.54,35.36 | 30.54,35.36 30.54,35.19 | 30.54,35.36 30.58,35.36 | 55.68,18.69 55.68,17.88 | 30.54,35.19 30.48,35.19 30.48,32.31 55.63,32.31 U$4.2 | 30.54,35.19 30.54,35.36
PPT_VOUT  (via drill 0.3)
  Top 0.203: U$2.P$5 35.15,83.7 35.15,81.48 21.74,81.48 21.74,64.82 30.68,64.82 v30.68,63.6
  pour Top (isolate 0.25, rank 2, no thermals): 25.04,46.33 31.04,46.33 31.04,63.94 30.04,63.94 30.04,56.94 25.04,56.94
PROG
  Top 0.203: U$1.P34 28.04,43.28 26.82,42.06 26.82,41.37 R_PROG.2
PROG1
  Top 0.203: U$5.P34 37.29,43.28 36.07,42.06 36.07,41.37 R_PROG1.2
PROG2
  Top 0.203: U$6.P34 46.53,43.28 45.31,42.06 45.31,41.37 R_PROG2.2
PROG3
  Top 0.203: U$7.P34 55.68,43.28 54.46,42.06 54.46,41.37 R_PROG3.2
PROG4
  Top 0.203: U$8.P34 64.82,43.48 63.6,42.27 63.6,41.57 R_PROG4.2
PROG5
  Top 0.203: U$9.P34 73.96,43.28 72.75,42.06 72.75,41.37 R_PROG5.2
PROG6
  Top 0.203: U$10.P34 83.11,43.28 81.89,42.06 81.89,41.37 R_PROG6.2
PROG7
  Top 0.203: U$11.P34 92.46,43.28 91.24,42.06 91.24,41.37 R_PROG7.2
PROG8
  Top 0.203: U$12.P34 101.6,43.28 100.38,42.06 100.38,41.37 R_PROG8.2
RAHS_EN  (via drill 0.3)  (1 unrouted)
  Top 0.203: U$10.P33 82.61,43.39 81.89,42.67 80.94,42.67 R6.2 | 79.55,41.25 80.73,41.25 80.73,35.06 | 80.73,35.06 80.67,35.06 | v80.67,34.75 80.73,34.75 80.73,35.06
  Bottom 0.203: 80.87,34.75 v80.67,34.75 | v80.67,34.75 81.08,34.75 | v80.67,34.75 80.67,33.02 69.6,33.02 69.6,15.44 70.87,15.44 U$4.13
RAHS_IMON  (1 unrouted)
  Top 0.203: U$10.P2 85.11,44.44 85.36,44.19 85.36,42.44 85.51,42.44 R_IMON6.2 | 86.61,41.31 85.61,41.31 85.61,35.36 | 85.61,35.36 85.65,35.36 | 85.61,35.19 85.65,35.19 | 85.61,35.19 85.55,35.19 85.55,33.02 70.87,33.02 U$4.14 | 85.61,35.19 85.61,35.36
RAHS_VOUT  (via drill 0.3)
  Top 0.203: U$2.P$93 90.63,83.7 90.63,65.63 85.75,65.63 v85.75,63.6
  pour Top (isolate 0.25, rank 2, no thermals): 80.11,46.33 86.11,46.33 86.11,63.94 85.11,63.94 85.11,56.94 80.11,56.94
SET
  Top 0.203: U$1.P3 31.44,44.94 R_SET.1
SET1
  Top 0.203: U$5.P3 40.69,44.94 R_SET1.1
SET2
  Top 0.203: U$6.P3 49.93,44.94 R_SET2.1
SET3
  Top 0.203: U$7.P3 59.08,44.94 R_SET3.1
SET4
  Top 0.203: U$8.P3 68.22,45.14 R_SET4.1
SET5
  Top 0.203: U$9.P3 77.36,44.94 R_SET5.1
SET6
  Top 0.203: U$10.P3 86.51,44.94 R_SET6.1
SET7
  Top 0.203: U$11.P3 95.86,44.94 R_SET7.1
SET8
  Top 0.203: U$12.P3 105,44.94 R_SET8.1
SW
  pour Top (rank 2, no thermals): 33.53,74.37 31.29,74.37 31.29,76.61 30.28,76.61 30.28,80.87 34.54,80.87 34.54,76 33.53,76
SW1
  pour Top (rank 2, no thermals): 57.71,74.17 55.47,74.17 55.47,76.4 54.46,76.4 54.46,80.67 58.72,80.67 58.72,75.79 57.71,75.79
TIMER
  Top 0.203: U$1.P35 28.54,42.58 29.26,41.86 29.26,41.37 C_TIMER.1
TIMER1
  Top 0.203: U$5.P35 37.79,42.58 38.51,41.86 38.51,41.37 C_TIMER1.1
TIMER2
  Top 0.203: U$6.P35 47.03,42.58 47.75,41.86 47.75,41.37 C_TIMER2.1
TIMER3
  Top 0.203: U$7.P35 56.18,42.58 56.9,41.86 56.9,41.37 C_TIMER3.1
TIMER4
  Top 0.203: U$8.P35 65.32,42.78 66.04,42.06 66.04,41.57 C_TIMER4.1
TIMER5
  Top 0.203: U$9.P35 74.46,42.58 75.18,41.86 75.18,41.37 C_TIMER5.1
TIMER6
  Top 0.203: U$10.P35 83.61,42.58 84.33,41.86 84.33,41.37 C_TIMER6.1
TIMER7
  Top 0.203: U$11.P35 92.96,42.58 93.68,41.86 93.68,41.37 C_TIMER7.1
TIMER8
  Top 0.203: U$12.P35 102.1,42.58 102.82,41.86 102.82,41.37 C_TIMER8.1
VCC  (via drill 0.3)  (14 unrouted)
  Top 0.203: U$7.P29 53.08,44.94 C4.1 | R_SET3.2 59.24,43.15 v59.15,43.41 | v51.68,45.52 51.68,44.94 | U$8.P29 62.22,45.14 C5.1 | R_SET4.2 68.38,43.35 v68.3,43.62 | v60.82,45.72 60.82,45.14 | U$9.P29 71.36,44.94 C6.1 | R_SET5.2 77.53,43.15 v77.44,43.41 | v69.96,45.52 69.96,44.94 | U$10.P29 80.51,44.94 C7.1 | R_SET6.2 86.67,43.15 v86.58,43.41 | v79.11,45.52 79.11,44.94 | U$11.P29 89.86,44.94 C8.1 | R_SET7.2 96.02,43.15 v95.93,43.41 | v88.46,45.52 88.46,44.94 | U$12.P29 99,44.94 C9.1 | R_SET8.2 105.16,43.15 v105.08,43.41 | v97.6,45.52 97.6,44.94 | R_SET.2 31.61,43.15 v31.52,43.41 | U$1.P29 25.44,44.94 C3.1 | v24.04,45.52 24.04,44.94 | U$13.P$2 29.67,74.32 29.26,73.96 | 29.38,73.96 C11.1 | U$14.P$2 53.85,74.11 53.44,73.76 | 53.57,73.76 C15.1 | v28.04,61.57 27.64,61.57 v27.64,67.26 | v55.68,61.57 51.82,61.57 v51.82,67.06
  Top 0.406: 29.26,73.96 29.38,73.96 | 53.44,73.76 53.57,73.76
  Bottom 0.203: v59.15,43.41 59.68,45.52 | 59.68,45.52 59.68,56.44 55.68,56.44 v55.68,57.44 | 59.68,45.52 v51.68,45.52 | v68.3,43.62 68.82,45.72 | 68.82,45.72 68.82,56.64 64.82,56.64 v64.82,57.64 | 68.82,45.72 v60.82,45.72 | v77.44,43.41 77.96,45.52 | 77.96,45.52 77.96,56.44 73.96,56.44 v73.96,57.44 | 77.96,45.52 v69.96,45.52 | v86.58,43.41 87.11,45.52 | 87.11,45.52 87.11,56.44 83.11,56.44 v83.11,57.44 | 87.11,45.52 v79.11,45.52 | v95.93,43.41 96.46,45.52 | 96.46,45.52 96.46,56.44 92.46,56.44 v92.46,57.44 | 96.46,45.52 v88.46,45.52 | v105.08,43.41 105.6,45.52 | 105.6,45.52 105.6,56.44 101.6,56.44 v101.6,57.44 | 105.6,45.52 v97.6,45.52 | v28.04,57.44 28.04,56.44 32.04,56.44 32.04,45.52 | v31.52,43.41 32.04,45.52 | 32.04,45.52 v24.04,45.52 | v101.8,61.57 v92.66,61.57 v83.31,61.57 v73.96,61.57 v64.82,61.57 v55.68,61.57 v28.04,61.57
  pour Top (rank 3, no thermals): 27.04,58.44 29.04,58.44 29.04,64.06 27.04,64.06
  pour Top (rank 3, no thermals): 54.68,58.44 56.68,58.44 56.68,64.06 54.68,64.06
  pour Top (rank 3, no thermals): 63.82,58.64 65.82,58.64 65.82,64.27 63.82,64.27
  pour Top (rank 3, no thermals): 72.96,58.44 74.96,58.44 74.96,64.06 72.96,64.06
  pour Top (rank 3, no thermals): 82.11,58.44 84.11,58.44 84.11,64.06 82.11,64.06
  pour Top (rank 3, no thermals): 91.46,58.44 93.46,58.44 93.46,64.06 91.46,64.06
  pour Top (rank 3, no thermals): 100.6,58.44 102.6,58.44 102.6,64.06 100.6,64.06
  pour Top (no thermals): 30.68,66.85 30.68,73.56 25.81,73.56 25.81,66.85
  pour Top (no thermals): 54.86,66.65 54.86,73.36 49.99,73.36 49.99,66.65